# Altium project DVT-SPI_Buffer.PrjPcb (part 1 of 2)
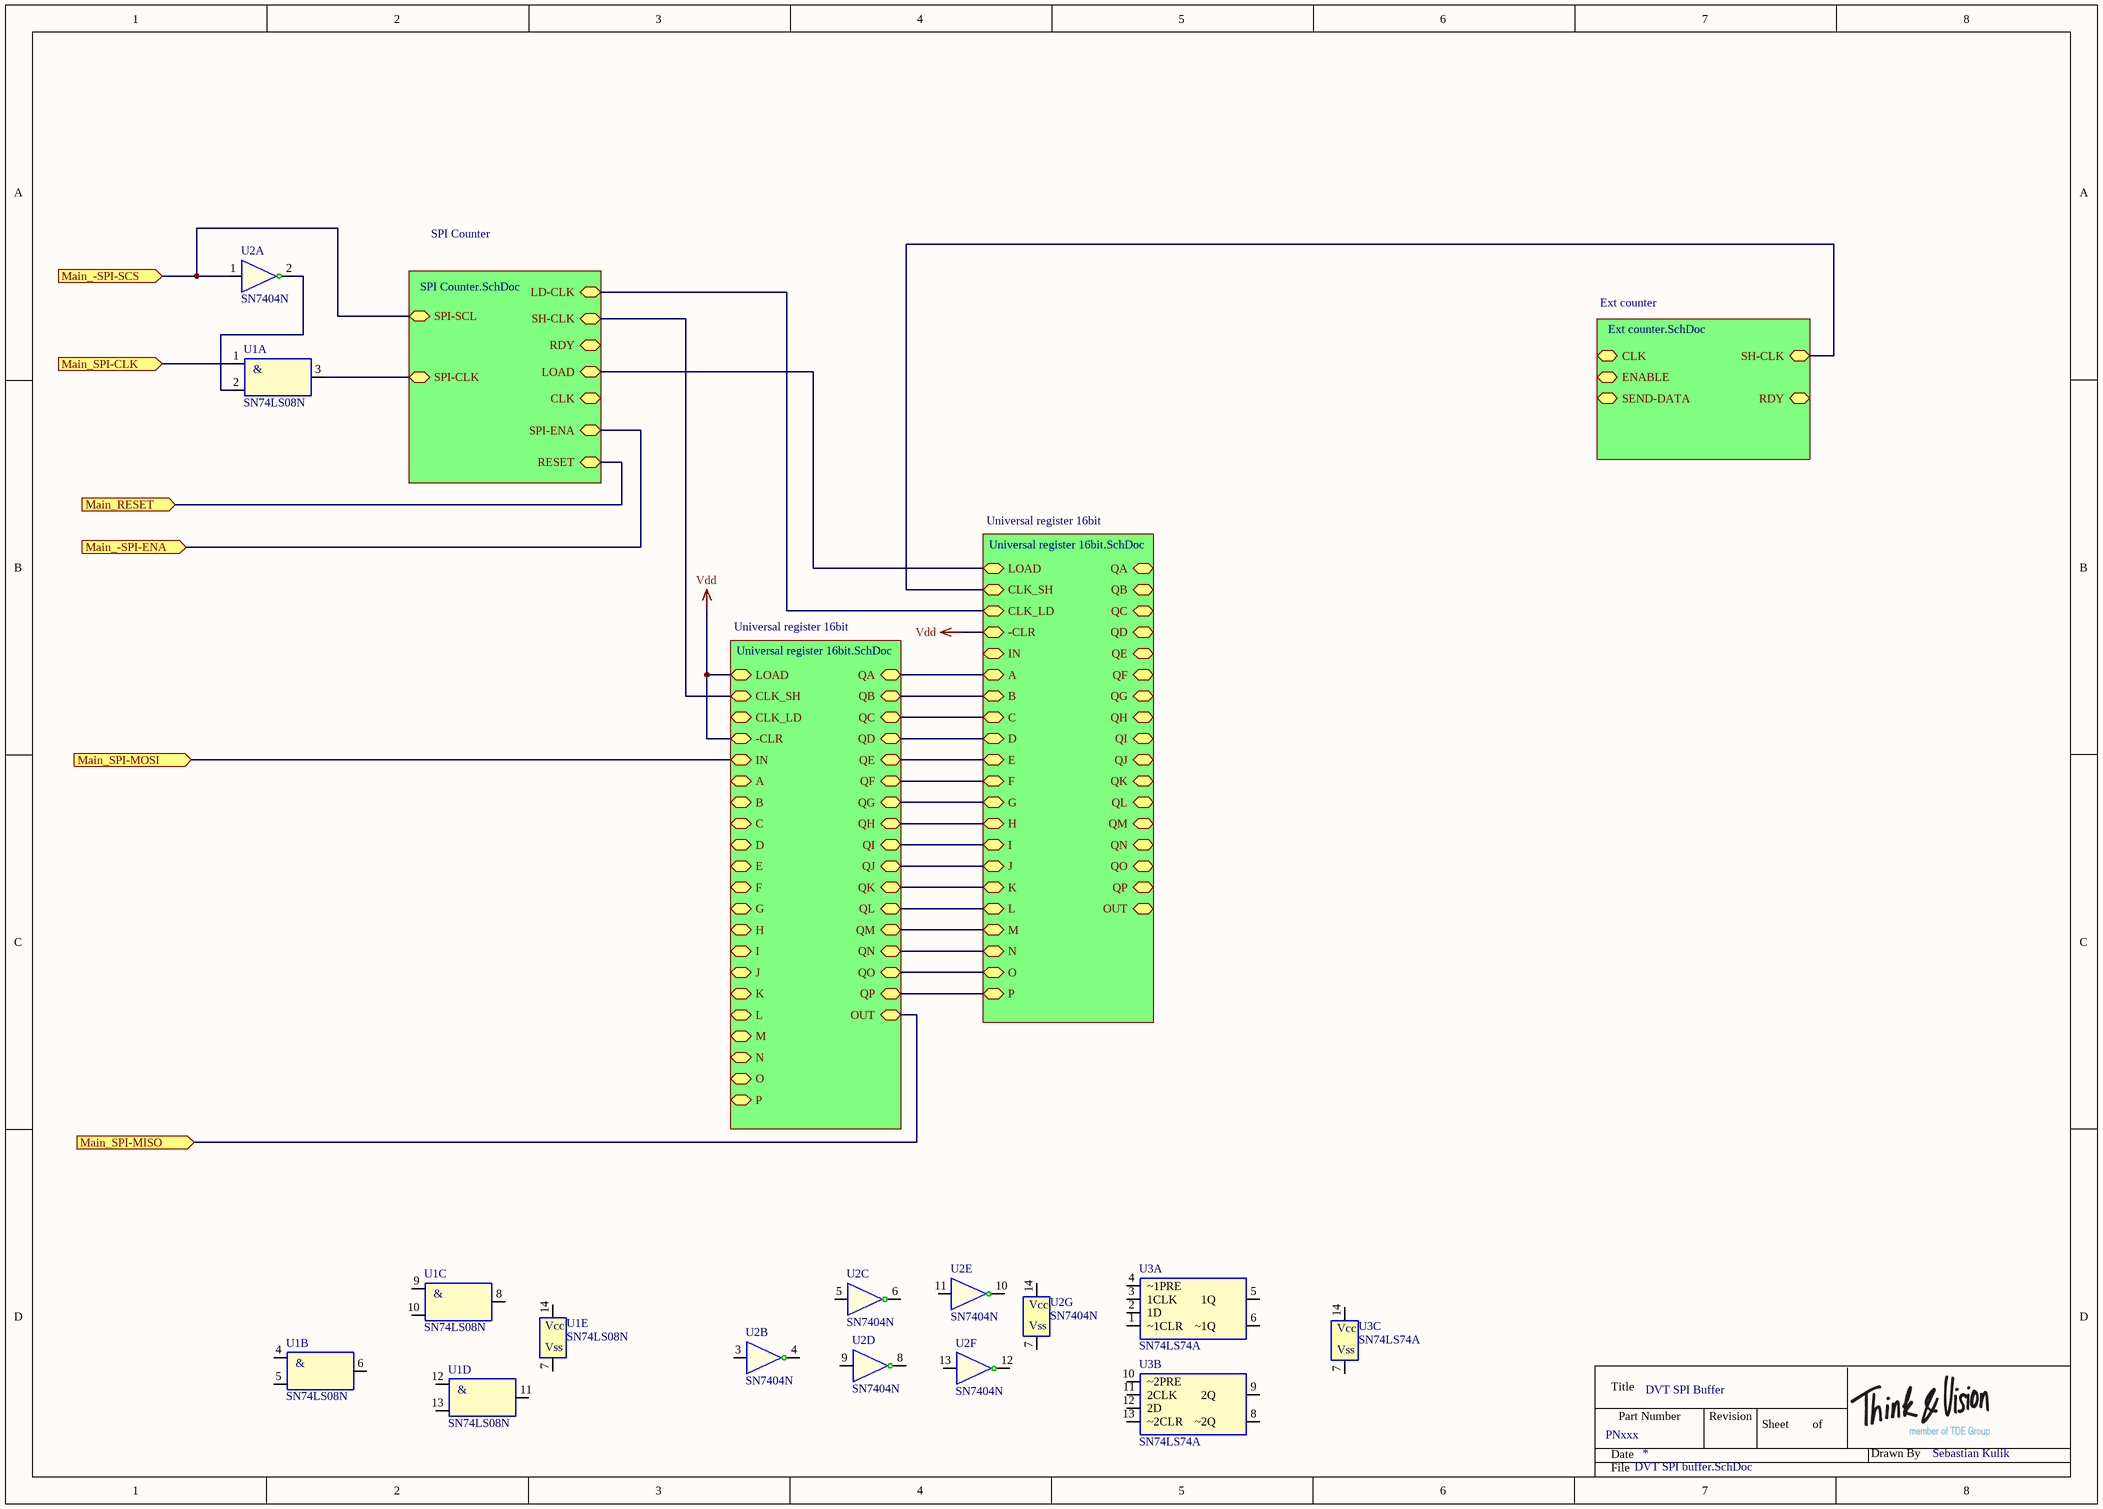
[diagram p0: DVT SPI buffer.SchDoc]
7 sheets, 125 parts. Net scope: hierarchical (ports join the sheet entries above them; power ports are global).
Sheets:
  DVT SPI buffer.SchDoc
    SPI Counter = SPI Counter.SchDoc
      J-K-Flip-Flop = J-K-Flip-Flop.SchDoc
    Universal register 16bit = Universal register 16bit.SchDoc
      Universal Register 4Bit = Universal Register 4Bit.SchDoc
        Quad 2x1 mux = Quad 2x1 mux.SchDoc
      Quad 2x1 mux = Quad 2x1 mux.SchDoc
      Universal Register 4Bit = Universal Register 4Bit.SchDoc
        Quad 2x1 mux = Quad 2x1 mux.SchDoc
      Universal Register 4Bit = Universal Register 4Bit.SchDoc
        Quad 2x1 mux = Quad 2x1 mux.SchDoc
      Universal Register 4Bit = Universal Register 4Bit.SchDoc
        Quad 2x1 mux = Quad 2x1 mux.SchDoc
    Ext counter = Ext counter.SchDoc
    Universal register 16bit = Universal register 16bit.SchDoc
      Universal Register 4Bit = Universal Register 4Bit.SchDoc
        Quad 2x1 mux = Quad 2x1 mux.SchDoc
      Quad 2x1 mux = Quad 2x1 mux.SchDoc
      Universal Register 4Bit = Universal Register 4Bit.SchDoc
        Quad 2x1 mux = Quad 2x1 mux.SchDoc
      Universal Register 4Bit = Universal Register 4Bit.SchDoc
        Quad 2x1 mux = Quad 2x1 mux.SchDoc
      Universal Register 4Bit = Universal Register 4Bit.SchDoc
        Quad 2x1 mux = Quad 2x1 mux.SchDoc

## Sheet DVT SPI buffer.SchDoc: DVT SPI Buffer
size A3; Revision: 1; SheetNumber: 1; SheetTotal: ?; PartNumber: PNxxx; Drawn By: Sebastian Kulik; ProjectName: DVT SPI Buffer

### Parts
(Parts that share a designator on the sheet are numbered #1, #2 ... from top to bottom, then left to right.)
U1#1  SN74LS08N  [DIP-14]  (parts A,B,C,D,E of 5)
U2#1  SN7404N  [DIP-14]  (parts A,B,C,D,E,F,G of 7)
U3#1  SN74LS74A  [DIP-14]  (parts A,B,C of 3)

### Sub-sheets
Ext counter = Ext counter.SchDoc: CLK, ENABLE, SEND-DATA, SH-CLK, RDY
SPI Counter = SPI Counter.SchDoc: SPI-SCL, CLK, SPI-CLK, LD-CLK, SH-CLK, RDY, LOAD, RESET, SPI-ENA
Universal register 16bit = Universal register 16bit.SchDoc: LOAD, CLK_SH, CLK_LD, -CLR, IN, A, B, C, D, E, F, G, H, I, J, K, L, M, N, O, QA, QB, QC, QD, QE, QF, QG, QH, QI, QJ, QK, QL, QM, QN, QO, QP, OUT, P
Universal register 16bit = Universal register 16bit.SchDoc: LOAD, CLK_SH, CLK_LD, -CLR, IN, A, B, C, D, E, F, G, H, I, J, K, L, M, N, O, QA, QB, QC, QD, QE, QF, QG, QH, QI, QJ, QK, QL, QM, QN, QO, QP, OUT, P

### Ports
Main_-SPI-ENA (in), Main_-SPI-SCS (in), Main_RESET (in), Main_SPI-CLK (in), Main_SPI-MISO (in), Main_SPI-MOSI (in)

### Nets
Vdd: sheet Universal register 16bit/LOAD, sheet Universal register 16bit/-CLR, sheet Universal register 16bit/-CLR
NetU1#1_1: U1#1.1(1A) ; port Main_SPI-CLK
NetU1#1_2: U1#1.2(1B) U2#1.2(1Y)
NetU1#1_3: U1#1.3(Y1) ; sheet SPI Counter/SPI-CLK
NetU1#2_5: U2#1.1(1A) ; port Main_-SPI-SCS, sheet SPI Counter/SPI-SCL
NetU1#2_11: sheet SPI Counter/LD-CLK, sheet Universal register 16bit/CLK_LD
NetU1_Universal_register_16bit_Quad_2x1_mux#2_1: sheet SPI Counter/LOAD, sheet Universal register 16bit/LOAD
NetU1_Universal_register_16bit_Universal_Register_4Bit#1_5: sheet Universal register 16bit/QA, sheet Universal register 16bit/A
NetU1_Universal_register_16bit_Universal_Register_4Bit#1_9: sheet Universal register 16bit/QB, sheet Universal register 16bit/B
NetU1_Universal_register_16bit_Universal_Register_4Bit#2_5: sheet Universal register 16bit/QE, sheet Universal register 16bit/E
NetU1_Universal_register_16bit_Universal_Register_4Bit#2_9: sheet Universal register 16bit/QF, sheet Universal register 16bit/F
NetU1_Universal_register_16bit_Universal_Register_4Bit#3_5: sheet Universal register 16bit/QI, sheet Universal register 16bit/I
NetU1_Universal_register_16bit_Universal_Register_4Bit#3_9: sheet Universal register 16bit/QJ, sheet Universal register 16bit/J
NetU1_Universal_register_16bit_Universal_Register_4Bit#4_5: sheet Universal register 16bit/QM, sheet Universal register 16bit/M
NetU1_Universal_register_16bit_Universal_Register_4Bit#4_9: sheet Universal register 16bit/QN, sheet Universal register 16bit/N
NetU2#2_11: sheet SPI Counter/SH-CLK, sheet Universal register 16bit/CLK_SH
NetU2_Universal_register_16bit_Quad_2x1_mux#2_1: sheet Ext counter/SH-CLK, sheet Universal register 16bit/CLK_SH
NetU2_Universal_register_16bit_Universal_Register_4Bit#1_5: sheet Universal register 16bit/QC, sheet Universal register 16bit/C
NetU2_Universal_register_16bit_Universal_Register_4Bit#1_9: sheet Universal register 16bit/QD, sheet Universal register 16bit/D
NetU2_Universal_register_16bit_Universal_Register_4Bit#2_5: sheet Universal register 16bit/QG, sheet Universal register 16bit/G
NetU2_Universal_register_16bit_Universal_Register_4Bit#2_9: sheet Universal register 16bit/QH, sheet Universal register 16bit/H
NetU2_Universal_register_16bit_Universal_Register_4Bit#3_5: sheet Universal register 16bit/QK, sheet Universal register 16bit/K
NetU2_Universal_register_16bit_Universal_Register_4Bit#3_9: sheet Universal register 16bit/QL, sheet Universal register 16bit/L
NetU2_Universal_register_16bit_Universal_Register_4Bit#4_5: sheet Universal register 16bit/QO, sheet Universal register 16bit/O
NetU2_Universal_register_16bit_Universal_Register_4Bit#4_9: port Main_SPI-MISO, sheet Universal register 16bit/QP, sheet Universal register 16bit/OUT, sheet Universal register 16bit/P
NetU2_Universal_register_16bit_Universal_Register_4Bit#8_9: sheet Universal register 16bit/QP, sheet Universal register 16bit/OUT
NetU2_Universal_register_16bit_Universal_Register_4Bit_Quad_2x1_mux#1_1: port Main_SPI-MOSI, sheet Universal register 16bit/IN
NetU3#2_3: port Main_-SPI-ENA, sheet SPI Counter/SPI-ENA
NetU4#1_11: port Main_RESET, sheet SPI Counter/RESET

Not connected (* = marked no-connect by the designer): U1#1 4(2A) 5(2B) 6(Y2) 7(Vss) 8(Y3) 9(3A) 10(3B) 11(Y4) 12(4A) 13(4B) 14(Vcc); U2#1 3(2A) 4(2Y) 5(3A) 6(3Y) 7(Vss) 8(Y4) 9(4A) 10(5Y) 11(5A) 12(6Y) 13(6A) 14(Vcc); U3#1 1(~1CLR) 2(1D) 3(1CLK) 4(~1PRE) 5(1Q) 6(~1Q) 7(Vss) 8(~2Q) 9(2Q) 10(~2PRE) 11(2CLK) 12(2D) 13(~2CLR) 14(Vcc)

### Notes on the sheet
- Title
- Date
- Part Number
- Revision
- Sheet
- of
- Drawn By
- File
- (in symbol SN74LS08N, part A) &
- (in symbol SN74LS08N, part B) &
- (in symbol SN74LS08N, part C) &
- (in symbol SN74LS08N, part D) &

### Library data of the parts
U1#1 = SN74LS08N: Quad AND, TTL; Deliverer PartNr: 307-519; Manufacturer: TI; Deliverer: RS; TDE-PN: IC0088; Published: 24.11.2016; PackageDescription: DIP14; Publisher: Sebastian Kulik; Manufacturer PartNr: SN74LS08N; Price: 0.56
U2#1 = SN7404N: Hex Inverter TTL; Deliverer PartNr: 305-529; Manufacturer: TI; Deliverer: RS; TDE-PN: IC0086; Published: 24.11.2016; PackageDescription: DIP14; Publisher: Sebastian Kulik; Manufacturer PartNr: SN7404N; Price: 1
U3#1 = SN74LS74A: Flip-Flop Dual, TTL; Deliverer PartNr: 307-597; Manufacturer PartNr: SN74LS74AN; Manufacturer: TI; Deliverer: RS; TDE-PN: IC0089; Published: 24.11.2016; PackageDescription: DIP14; Publisher: Sebastian Kulik; Price: 0.48

## Sheet SPI Counter.SchDoc: SPI Counter
size A3; SheetNumber: 1; SheetTotal: 1; PartNumber: PNxxx; Drawn By: Sebastian Kulik; ProjectName: DVT SPI Buffer
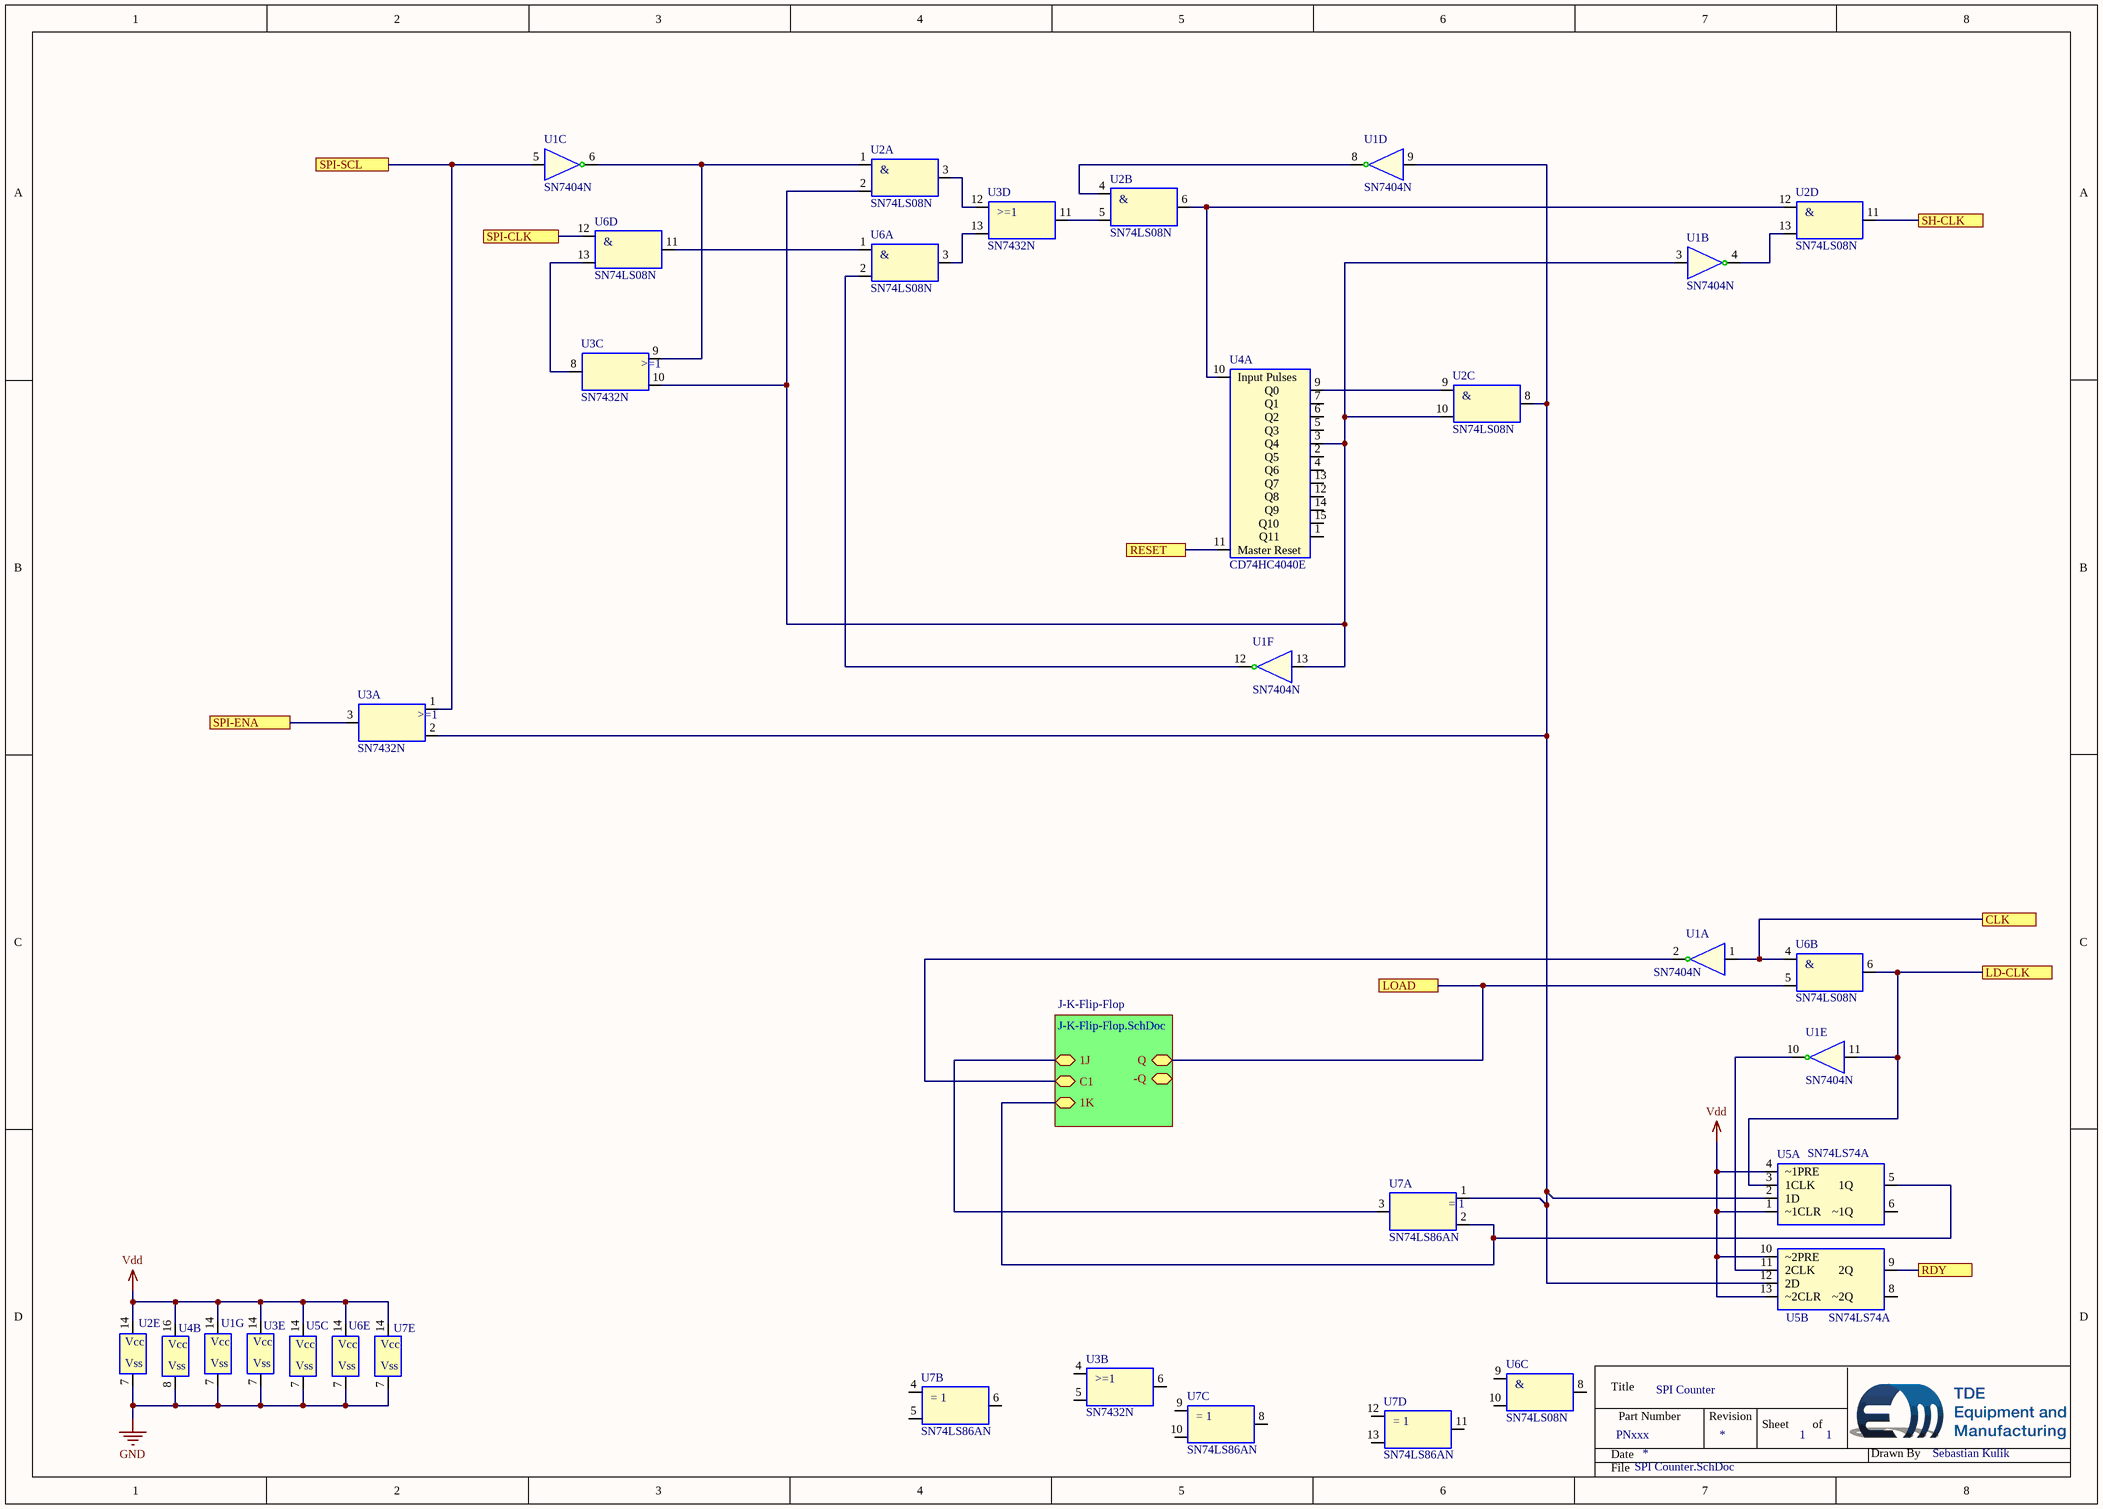
[diagram p1: SPI Counter.SchDoc]

### Parts
(Parts that share a designator on the sheet are numbered #1, #2 ... from top to bottom, then left to right.)
U1#2  SN7404N  [DIP-14]  (parts A,B,C,D,E,F,G of 7)
U2#2  SN74LS08N  [DIP-14]  (parts A,B,C,D,E of 5)
U3#2  SN7432N  [DIP-14]  (parts A,B,C,D,E of 5)
U4#1  CD74HC4040E  [DIP-16]  (parts A,B of 2)
U5#1  SN74LS74A  [DIP-14]  (parts A,B,C of 3)
U6#1  SN74LS08N  [DIP-14]  (parts A,B,C,D,E of 5)
U7  SN74LS86AN  [DIP-14]  (parts A,B,C,D,E of 5)

### Sub-sheets
J-K-Flip-Flop = J-K-Flip-Flop.SchDoc: 1J, C1, 1K, Q, -Q

### Ports
CLK, LD-CLK, LOAD, RDY, RESET, SH-CLK, SPI-CLK, SPI-ENA, SPI-SCL

### Nets
GND: U1#2.7(Vss) U2#2.7(Vss) U3#2.7(Vss) U4#1.8(Vss) U5#1.7(Vss) U6#1.7(Vss) U7.7(Vss)
Vdd: U1#2.14(Vcc) U2#2.14(Vcc) U3#2.14(Vcc) U4#1.16(Vcc) U5#1.1(~1CLR) U5#1.4(~1PRE) U5#1.10(~2PRE) U5#1.13(~2CLR) U5#1.14(Vcc) U6#1.14(Vcc) U7.14(Vcc)
NetCLK-DELAY_1: U1#2.2(1Y) ; sheet J-K-Flip-Flop/C1
NetU1#1_3: U6#1.12(4A) ; port SPI-CLK
NetU1#2_1: U1#2.1(1A) U6#1.4(2A) ; port CLK
NetU1#2_3: U1#2.3(2A) U1#2.13(6A) U2#2.2(1B) U2#2.10(3B) U3#2.10(3B) U4#1.3(Q4)
NetU1#2_4: U1#2.4(2Y) U2#2.13(4B)
NetU1#2_5: U1#2.5(3A) U3#2.1(1A) ; port SPI-SCL
NetU1#2_6: U1#2.6(3Y) U2#2.1(1A) U3#2.9(3A)
NetU1#2_8: U1#2.8(Y4) U2#2.4(2A)
NetU1#2_9: U1#2.9(4A) U2#2.8(Y3) U3#2.2(1B) U5#1.2(1D) U5#1.12(2D) U7.1(1A)
NetU1#2_10: U1#2.10(5Y) U5#1.11(2CLK)
NetU1#2_11: U1#2.11(5A) U5#1.3(1CLK) U6#1.6(Y2) ; port LD-CLK
NetU1#2_12: U1#2.12(6Y) U6#1.2(1B)
NetU1#3_11: U5#1.5(1Q) U7.2(1B) ; sheet J-K-Flip-Flop/1K
NetU1_Universal_register_16bit_Quad_2x1_mux#2_1: U6#1.5(2B) ; port LOAD, sheet J-K-Flip-Flop/Q
NetU2#2_3: U2#2.3(Y1) U3#2.12(4A)
NetU2#2_5: U2#2.5(2B) U3#2.11(Y4)
NetU2#2_6: U2#2.6(Y2) U2#2.12(4A) U4#1.10(Input_Pulses)
NetU2#2_9: U2#2.9(3A) U4#1.9(Q0)
NetU2#2_11: U2#2.11(Y4) ; port SH-CLK
NetU2#3_1: U7.3(Y1) ; sheet J-K-Flip-Flop/1J
NetU3#2_3: U3#2.3(Y1) ; port SPI-ENA
NetU3#2_8: U3#2.8(Y3) U6#1.13(4B)
NetU3#2_13: U3#2.13(4B) U6#1.3(Y1)
NetU4#1_11: U4#1.11(Master_Reset) ; port RESET
NetU5#1_9: U5#1.9(2Q) ; port RDY
NetU6#1_1: U6#1.1(1A) U6#1.11(Y4)

Not connected (* = marked no-connect by the designer): U3#2 4(2A) 5(2B) 6(Y2); U4#1 1(Q11) 2(Q5) 4(Q6) 5(Q3) 6(Q2) 7(Q1) 12(Q8) 13(Q7) 14(Q9) 15(Q10); U5#1 6(~1Q) 8(~2Q); U6#1 8(Y3) 9(3A) 10(3B); U7 4(2A) 5(2B) 6(Y2) 8(Y3) 9(3A) 10(3B) 11(Y4) 12(4A) 13(4B)

### Notes on the sheet
- Title
- Date
- Part Number
- Revision
- Sheet
- of
- Drawn By
- File
- (in symbol SN74LS08N, part A) &
- (in symbol SN74LS08N, part B) &
- (in symbol SN74LS08N, part C) &
- (in symbol SN74LS08N, part D) &
- (in symbol SN7432N, part A) >=1
- (in symbol SN7432N, part B) >=1
- (in symbol SN7432N, part C) >=1
- (in symbol SN7432N, part D) >=1

### Library data of the parts
U1#2 = SN7404N: as U2#1 on sheet DVT SPI buffer; Published: 24.11.2016; PackageDescription: DIP14; Publisher: Sebastian Kulik; Manufacturer PartNr: SN7404N; Price: 1
U2#2 U6#1 = SN74LS08N: as U1#1 on sheet DVT SPI buffer; Published: 24.11.2016; PackageDescription: DIP14; Publisher: Sebastian Kulik; Manufacturer PartNr: SN74LS08N; Price: 0.56
U3#2 = SN7432N: Quad NAND, TTL; Deliverer PartNr: 304-093; Manufacturer: TI; Deliverer: RS; TDE-PN: IC0087; Published: 24.11.2016; PackageDescription: DIP14; Publisher: Sebastian Kulik; Manufacturer PartNr: SN7432N; Price: 1.24
U4#1 = CD74HC4040E: High Speed CMOS Logic 12-Stage Binary Counter; Deliverer PartNr: 807-2457; Manufacturer: TI; Deliverer: RS; TDE-PN: IC0090; Published: 09.12.2016; PackageDescription: DIP16; Publisher: Sebastian Kulik; Manufacturer PartNr: CD74HC4040E; Price: 0.464/25
U5#1 = SN74LS74A: as U3#1 on sheet DVT SPI buffer; Published: 24.11.2016; PackageDescription: DIP14; Publisher: Sebastian Kulik; Price: 0.48
U7 = SN74LS86AN: Quad 2-input exclusive-OR gates; Deliverer PartNr: 304-093; Manufacturer: TI; Deliverer: RS; TDE-PN: IC0091; Published: 12.12.2016; PackageDescription: DIP14; Publisher: Sebastian Kulik; Manufacturer PartNr: SN74LS86AN; Price: 2.26/1

## Sheet J-K-Flip-Flop.SchDoc: J-K-Flip-Flop
size A4; Revision: 1; SheetNumber: 1; SheetTotal: 1; PartNumber: PNxxx; Drawn By: Sebastian Kulik
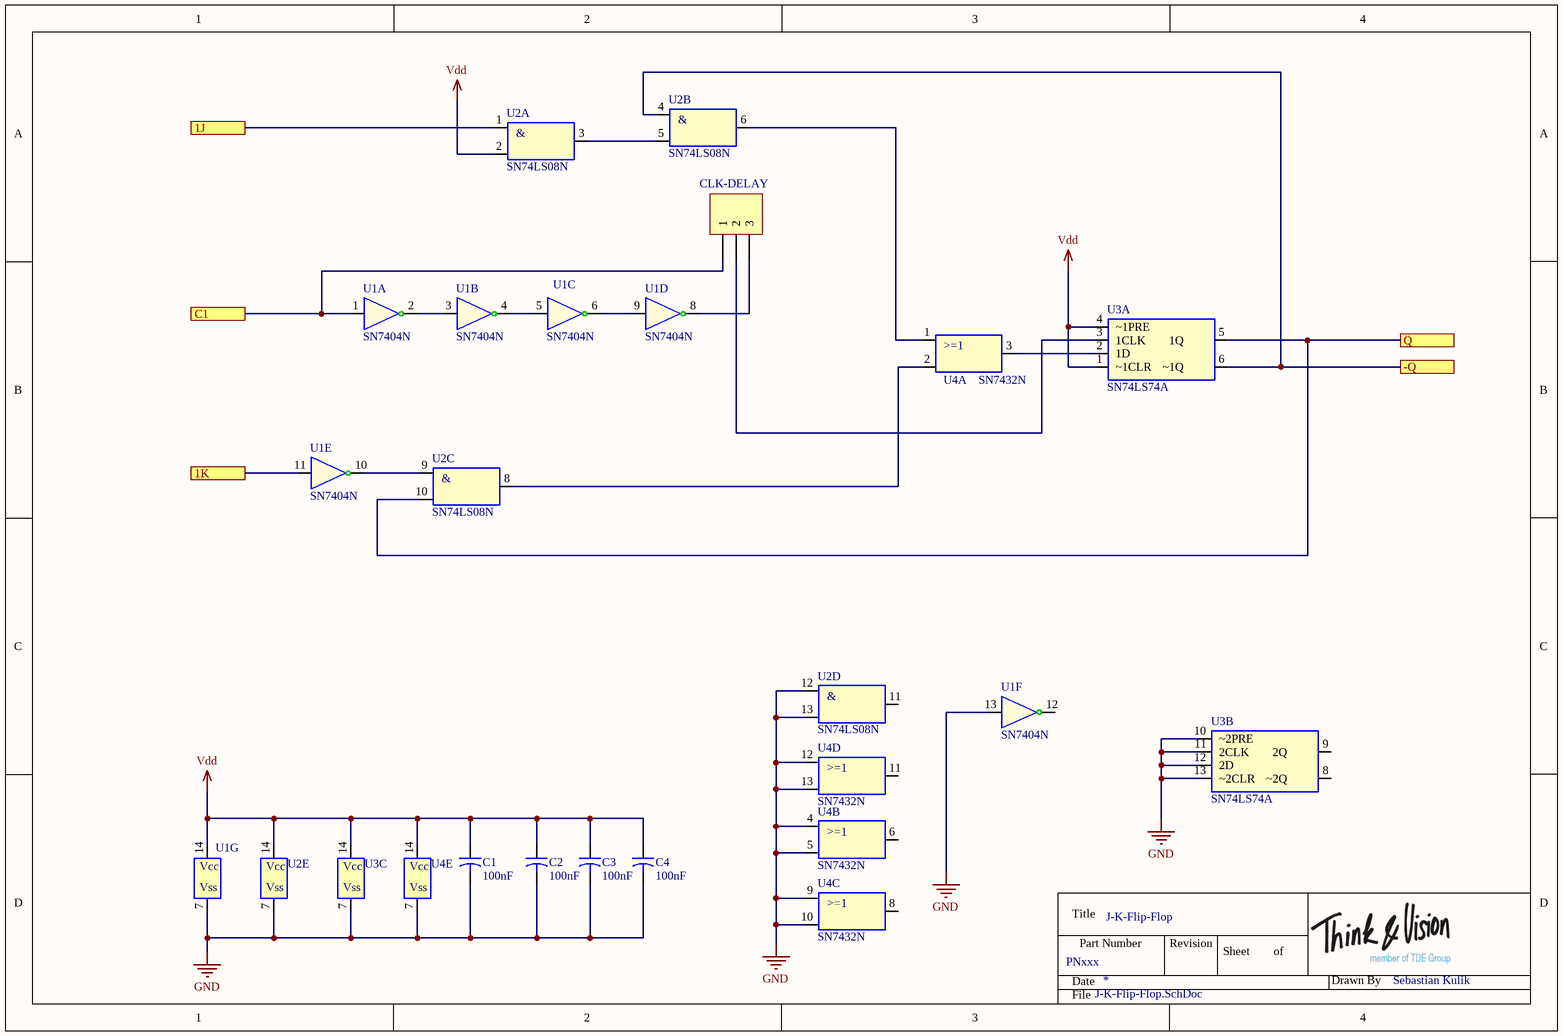
[diagram p2: J-K-Flip-Flop.SchDoc]

### Parts
(Parts that share a designator on the sheet are numbered #1, #2 ... from top to bottom, then left to right.)
C1#1  value 100nF  [Dummy-10mm]  (hidden comment: Capacitor-Dummy-THT)
C2#1  value 100nF  [Dummy-10mm]  (hidden comment: Capacitor-Dummy-THT)
C3#1  value 100nF  [Dummy-10mm]  (hidden comment: Capacitor-Dummy-THT)
C4#1  value 100nF  [Dummy-10mm]  (hidden comment: Capacitor-Dummy-THT)
CLK-DELAY  Plug_3_90_2.54  [HDR1X3]  (value not drawn)
U1#3  SN7404N  [DIP-14]  (parts A,B,C,D,E,F,G of 7)
U2#3  SN74LS08N  [DIP-14]  (parts A,B,C,D,E of 5)
U3#3  SN74LS74A  [DIP-14]  (parts A,B,C of 3)
U4#2  SN7432N  [DIP-14]  (parts A,B,C,D,E of 5)

### Ports
1J, 1K, -Q, C1, Q

### Nets
GND: C1#1.2 C2#1.2 C3#1.2 C4#1.2 U1#3.7(Vss) U1#3.13(6A) U2#3.7(Vss) U2#3.12(4A) U2#3.13(4B) U3#3.7(Vss) U3#3.10(~2PRE) U3#3.11(2CLK) U3#3.12(2D) U3#3.13(~2CLR) U4#2.4(2A) U4#2.5(2B) U4#2.7(Vss) U4#2.9(3A) U4#2.10(3B) U4#2.12(4A) U4#2.13(4B)
Vdd: C1#1.1 C2#1.1 C3#1.1 C4#1.1 U1#3.14(Vcc) U2#3.2(1B) U2#3.14(Vcc) U3#3.1(~1CLR) U3#3.4(~1PRE) U3#3.14(Vcc) U4#2.14(Vcc)
NetCLK-DELAY_1: CLK-DELAY.1 U1#3.1(1A) ; port C1
NetCLK-DELAY_2: CLK-DELAY.2 U3#3.3(1CLK)
NetCLK-DELAY_3: CLK-DELAY.3 U1#3.8(Y4)
NetU1#3_2: U1#3.2(1Y) U1#3.3(2A)
NetU1#3_4: U1#3.4(2Y) U1#3.5(3A)
NetU1#3_6: U1#3.6(3Y) U1#3.9(4A)
NetU1#3_10: U1#3.10(5Y) U2#3.9(3A)
NetU1#3_11: U1#3.11(5A) ; port 1K
NetU1_Universal_register_16bit_Quad_2x1_mux#2_1: U2#3.10(3B) U3#3.5(1Q) ; port Q
NetU2#3_1: U2#3.1(1A) ; port 1J
NetU2#3_3: U2#3.3(Y1) U2#3.5(2B)
NetU2#3_4: U2#3.4(2A) U3#3.6(~1Q) ; port -Q
NetU2#3_6: U2#3.6(Y2) U4#2.1(1A)
NetU2#3_8: U2#3.8(Y3) U4#2.2(1B)
NetU3#3_2: U3#3.2(1D) U4#2.3(Y1)

Not connected (* = marked no-connect by the designer): U1#3 12(6Y); U2#3 11(Y4); U3#3 8(~2Q) 9(2Q); U4#2 6(Y2) 8(Y3) 11(Y4)

### Notes on the sheet
- Title
- Date
- Part Number
- Revision
- Sheet
- of
- Drawn By
- File
- (in symbol SN74LS08N, part A) &
- (in symbol SN74LS08N, part B) &
- (in symbol SN74LS08N, part C) &
- (in symbol SN74LS08N, part D) &
- (in symbol SN7432N, part A) >=1
- (in symbol SN7432N, part B) >=1
- (in symbol SN7432N, part C) >=1
- (in symbol SN7432N, part D) >=1

### Library data of the parts
C1#1 C2#1 C3#1 C4#1 = Capacitor-Dummy-THT: Deliverer PartNr: 721-5240; Deliverer: RS; Published: 08.12.2015; Part Description: Capacitor-Dummy-THT; Publisher: Sebastian Kulik; PackageDescription: -; Manufacturer: -; Manufacturer PartNr: -; TDE-PN: -; Price: 0.081/50
CLK-DELAY = Plug_3_90_2.54: Plug,-3-Pin; Manufacturer: WE; Manufacturer PartNr: 61300311021; Deliverer PartNr: 828-1585; Deliverer: RS; TDE-PN: CON0011; Publisher: Sebastian Kulik; Price: 0.138/5
U1#3 = SN7404N: as U2#1 on sheet DVT SPI buffer; Published: 24.11.2016; PackageDescription: DIP14; Publisher: Sebastian Kulik; Manufacturer PartNr: SN7404N; Price: 1
U2#3 = SN74LS08N: as U1#1 on sheet DVT SPI buffer; Published: 24.11.2016; PackageDescription: DIP14; Publisher: Sebastian Kulik; Manufacturer PartNr: SN74LS08N; Price: 0.56
U3#3 = SN74LS74A: as U3#1 on sheet DVT SPI buffer; Published: 24.11.2016; PackageDescription: DIP14; Publisher: Sebastian Kulik; Price: 0.48
U4#2 = SN7432N: as U3#2 on sheet SPI Counter; Published: 24.11.2016; PackageDescription: DIP14; Publisher: Sebastian Kulik; Manufacturer PartNr: SN7432N; Price: 1.24

## Sheet Universal register 16bit.SchDoc
size A3; PartNumber: PNxxx; Drawn By: Me?
Used 2 times, as channels Universal register 16bit, Universal register 16bit. Parts and nets are listed once, with the designators drawn on the sheet.
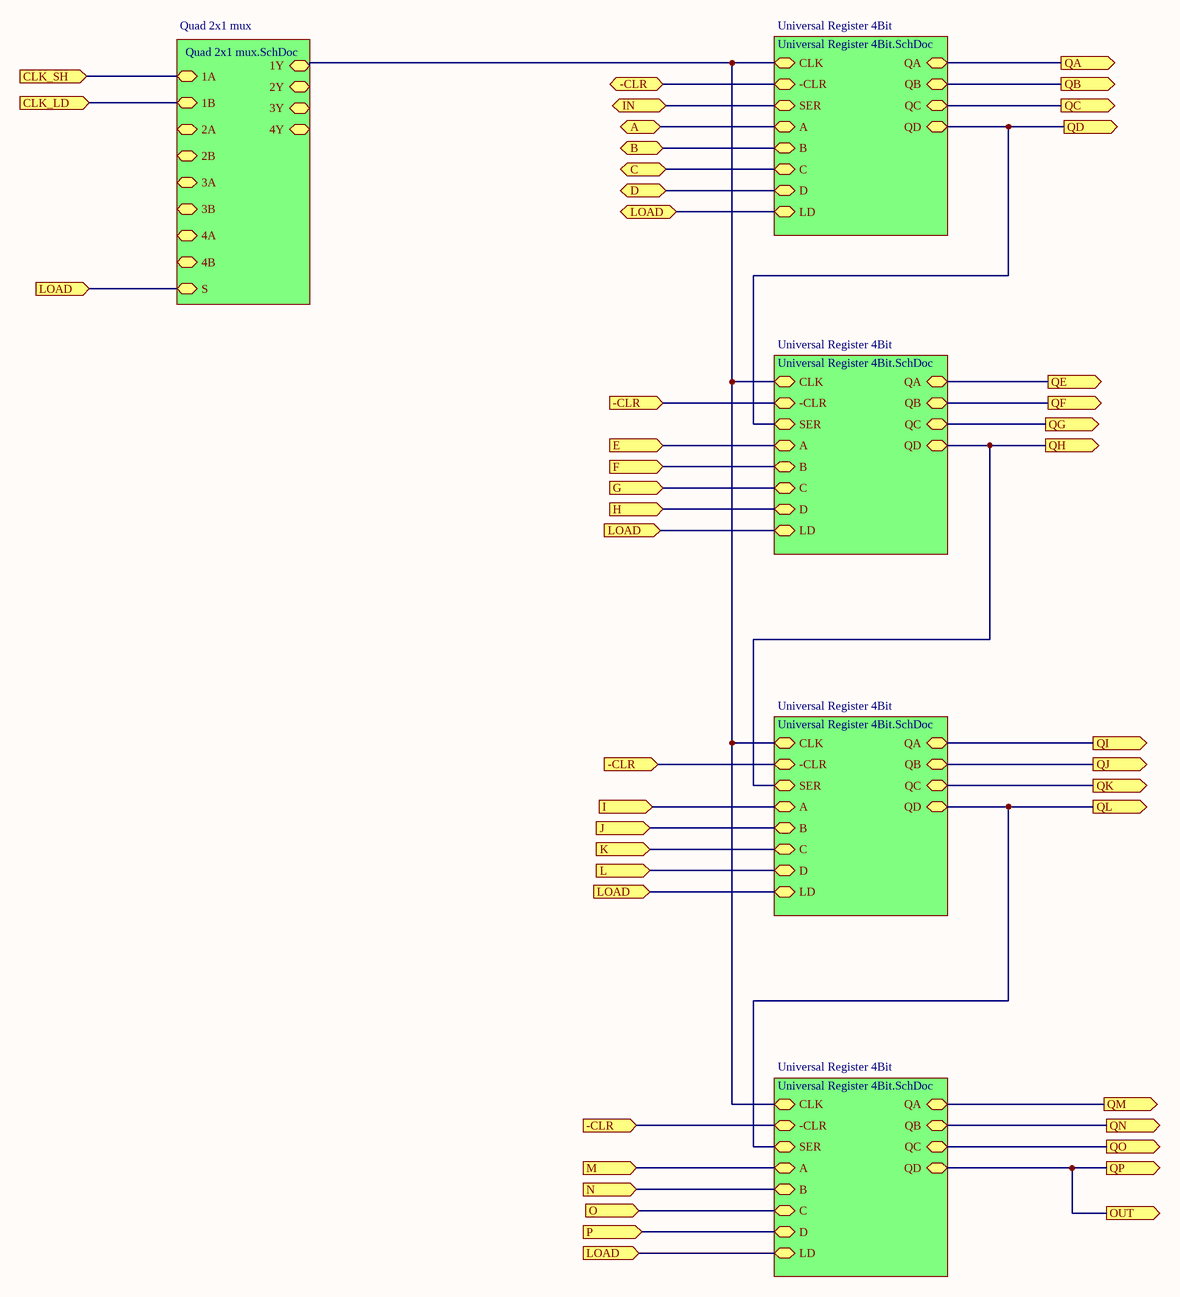
[diagram p3: Universal register 16bit.SchDoc]

### Sub-sheets
Quad 2x1 mux = Quad 2x1 mux.SchDoc: 1A, 1B, 2A, 2B, 3A, 3B, 4A, 4B, S, 1Y, 2Y, 3Y, 4Y
Universal Register 4Bit = Universal Register 4Bit.SchDoc: CLK, -CLR, SER, A, B, C, D, LD, QA, QB, QC, QD
Universal Register 4Bit = Universal Register 4Bit.SchDoc: CLK, -CLR, SER, A, B, C, D, LD, QA, QB, QC, QD
Universal Register 4Bit = Universal Register 4Bit.SchDoc: CLK, -CLR, SER, A, B, C, D, LD, QA, QB, QC, QD
Universal Register 4Bit = Universal Register 4Bit.SchDoc: CLK, -CLR, SER, A, B, C, D, LD, QA, QB, QC, QD

### Ports
-CLR (bidir), -CLR (in), A (bidir), B (bidir), C (bidir), CLK_LD (in), CLK_SH (in), D (bidir), E (in), F (in), G (in), H (in), I (in), IN (bidir), J (in), K (in), L (in), LOAD (bidir), LOAD (in), M (in), N (in), O (in), OUT (out), P (in), QA (out), QB (out), QC (out), QD (out), QE (out), QF (out), QG (out), QH (out), QI (out), QJ (out), QK (out), QL (out), QM (out), QN (out), QO (out), QP (out)

### Nets
-CLR: port -CLR, sheet Universal Register 4Bit/-CLR, sheet Universal Register 4Bit/-CLR, sheet Universal Register 4Bit/-CLR, sheet Universal Register 4Bit/-CLR
A: port A, sheet Universal Register 4Bit/A
B: port B, sheet Universal Register 4Bit/B
C: port C, sheet Universal Register 4Bit/C
CLK_LD: port CLK_LD, sheet Quad 2x1 mux/1B
CLK_SH: port CLK_SH, sheet Quad 2x1 mux/1A
D: port D, sheet Universal Register 4Bit/D
E: port E, sheet Universal Register 4Bit/A
F: port F, sheet Universal Register 4Bit/B
G: port G, sheet Universal Register 4Bit/C
H: port H, sheet Universal Register 4Bit/D
I: port I, sheet Universal Register 4Bit/A
IN: port IN, sheet Universal Register 4Bit/SER
J: port J, sheet Universal Register 4Bit/B
K: port K, sheet Universal Register 4Bit/C
L: port L, sheet Universal Register 4Bit/D
LOAD: port LOAD, sheet Universal Register 4Bit/LD, sheet Quad 2x1 mux/S, sheet Universal Register 4Bit/LD, sheet Universal Register 4Bit/LD, sheet Universal Register 4Bit/LD
M: port M, sheet Universal Register 4Bit/A
N: port N, sheet Universal Register 4Bit/B
O: port O, sheet Universal Register 4Bit/C
OUT: port QP, port OUT, sheet Universal Register 4Bit/QD
P: port P, sheet Universal Register 4Bit/D
QA: port QA, sheet Universal Register 4Bit/QA
QB: port QB, sheet Universal Register 4Bit/QB
QC: port QC, sheet Universal Register 4Bit/QC
QD: port QD, sheet Universal Register 4Bit/QD, sheet Universal Register 4Bit/SER
QE: port QE, sheet Universal Register 4Bit/QA
QF: port QF, sheet Universal Register 4Bit/QB
QG: port QG, sheet Universal Register 4Bit/QC
QH: port QH, sheet Universal Register 4Bit/QD, sheet Universal Register 4Bit/SER
QI: port QI, sheet Universal Register 4Bit/QA
QJ: port QJ, sheet Universal Register 4Bit/QB
QK: port QK, sheet Universal Register 4Bit/QC
QL: port QL, sheet Universal Register 4Bit/QD, sheet Universal Register 4Bit/SER
QM: port QM, sheet Universal Register 4Bit/QA
QN: port QN, sheet Universal Register 4Bit/QB
QO: port QO, sheet Universal Register 4Bit/QC
(unnamed): sheet Universal Register 4Bit/CLK, sheet Quad 2x1 mux/1Y, sheet Universal Register 4Bit/CLK, sheet Universal Register 4Bit/CLK, sheet Universal Register 4Bit/CLK

### Channels
Universal register 16bit: ports -CLR=Vdd A=NetU2_Universal_register_16bit_Universal_Register_4Bit_Quad_2x1_mux#1_5 B=NetU2_Universal_register_16bit_Universal_Register_4Bit_Quad_2x1_mux#1_13 C=NetU3_Universal_register_16bit_Universal_Register_4Bit_Quad_2x1_mux#1_5 CLK_LD=NetU2_Universal_register_16bit_Quad_2x1_mux#1_5 CLK_SH=NetU2#2_11 D=NetU3_Universal_register_16bit_Universal_Register_4Bit_Quad_2x1_mux#1_13 E=NetU2_Universal_register_16bit_Universal_Register_4Bit_Quad_2x1_mux#2_5 F=NetU2_Universal_register_16bit_Universal_Register_4Bit_Quad_2x1_mux#2_13 G=NetU3_Universal_register_16bit_Universal_Register_4Bit_Quad_2x1_mux#2_5 H=NetU3_Universal_register_16bit_Universal_Register_4Bit_Quad_2x1_mux#2_13 I=NetU2_Universal_register_16bit_Universal_Register_4Bit_Quad_2x1_mux#3_5 IN=NetU2_Universal_register_16bit_Universal_Register_4Bit_Quad_2x1_mux#1_1 J=NetU2_Universal_register_16bit_Universal_Register_4Bit_Quad_2x1_mux#3_13 K=NetU3_Universal_register_16bit_Universal_Register_4Bit_Quad_2x1_mux#3_5 L=NetU3_Universal_register_16bit_Universal_Register_4Bit_Quad_2x1_mux#3_13 LOAD=Vdd M=NetU2_Universal_register_16bit_Universal_Register_4Bit_Quad_2x1_mux#4_5 N=NetU2_Universal_register_16bit_Universal_Register_4Bit_Quad_2x1_mux#4_13 O=NetU3_Universal_register_16bit_Universal_Register_4Bit_Quad_2x1_mux#4_5 OUT=NetU2_Universal_register_16bit_Universal_Register_4Bit#4_9 P=NetU3_Universal_register_16bit_Universal_Register_4Bit_Quad_2x1_mux#4_13 QA=NetU1_Universal_register_16bit_Universal_Register_4Bit#1_5 QB=NetU1_Universal_register_16bit_Universal_Register_4Bit#1_9 QC=NetU2_Universal_register_16bit_Universal_Register_4Bit#1_5 QD=NetU2_Universal_register_16bit_Universal_Register_4Bit#1_9 QE=NetU1_Universal_register_16bit_Universal_Register_4Bit#2_5 QF=NetU1_Universal_register_16bit_Universal_Register_4Bit#2_9 QG=NetU2_Universal_register_16bit_Universal_Register_4Bit#2_5 QH=NetU2_Universal_register_16bit_Universal_Register_4Bit#2_9 QI=NetU1_Universal_register_16bit_Universal_Register_4Bit#3_5 QJ=NetU1_Universal_register_16bit_Universal_Register_4Bit#3_9 QK=NetU2_Universal_register_16bit_Universal_Register_4Bit#3_5 QL=NetU2_Universal_register_16bit_Universal_Register_4Bit#3_9 QM=NetU1_Universal_register_16bit_Universal_Register_4Bit#4_5 QN=NetU1_Universal_register_16bit_Universal_Register_4Bit#4_9 QO=NetU2_Universal_register_16bit_Universal_Register_4Bit#4_5 QP=NetU2_Universal_register_16bit_Universal_Register_4Bit#4_9
Universal register 16bit: ports -CLR=Vdd A=NetU1_Universal_register_16bit_Universal_Register_4Bit#1_5 B=NetU1_Universal_register_16bit_Universal_Register_4Bit#1_9 C=NetU2_Universal_register_16bit_Universal_Register_4Bit#1_5 CLK_LD=NetU1#2_11 CLK_SH=NetU2_Universal_register_16bit_Quad_2x1_mux#2_1 D=NetU2_Universal_register_16bit_Universal_Register_4Bit#1_9 E=NetU1_Universal_register_16bit_Universal_Register_4Bit#2_5 F=NetU1_Universal_register_16bit_Universal_Register_4Bit#2_9 G=NetU2_Universal_register_16bit_Universal_Register_4Bit#2_5 H=NetU2_Universal_register_16bit_Universal_Register_4Bit#2_9 I=NetU1_Universal_register_16bit_Universal_Register_4Bit#3_5 IN=NetU2_Universal_register_16bit_Universal_Register_4Bit_Quad_2x1_mux#5_1 J=NetU1_Universal_register_16bit_Universal_Register_4Bit#3_9 K=NetU2_Universal_register_16bit_Universal_Register_4Bit#3_5 L=NetU2_Universal_register_16bit_Universal_Register_4Bit#3_9 LOAD=NetU1_Universal_register_16bit_Quad_2x1_mux#2_1 M=NetU1_Universal_register_16bit_Universal_Register_4Bit#4_5 N=NetU1_Universal_register_16bit_Universal_Register_4Bit#4_9 O=NetU2_Universal_register_16bit_Universal_Register_4Bit#4_5 OUT=NetU2_Universal_register_16bit_Universal_Register_4Bit#8_9 P=NetU2_Universal_register_16bit_Universal_Register_4Bit#4_9 QA=NetU1_Universal_register_16bit_Universal_Register_4Bit#5_5 QB=NetU1_Universal_register_16bit_Universal_Register_4Bit#5_9 QC=NetU2_Universal_register_16bit_Universal_Register_4Bit#5_5 QD=NetU2_Universal_register_16bit_Universal_Register_4Bit#5_9 QE=NetU1_Universal_register_16bit_Universal_Register_4Bit#6_5 QF=NetU1_Universal_register_16bit_Universal_Register_4Bit#6_9 QG=NetU2_Universal_register_16bit_Universal_Register_4Bit#6_5 QH=NetU2_Universal_register_16bit_Universal_Register_4Bit#6_9 QI=NetU1_Universal_register_16bit_Universal_Register_4Bit#7_5 QJ=NetU1_Universal_register_16bit_Universal_Register_4Bit#7_9 QK=NetU2_Universal_register_16bit_Universal_Register_4Bit#7_5 QL=NetU2_Universal_register_16bit_Universal_Register_4Bit#7_9 QM=NetU1_Universal_register_16bit_Universal_Register_4Bit#8_5 QN=NetU1_Universal_register_16bit_Universal_Register_4Bit#8_9 QO=NetU2_Universal_register_16bit_Universal_Register_4Bit#8_5 QP=NetU2_Universal_register_16bit_Universal_Register_4Bit#8_9

### Notes on the sheet
- Title
- Date
- Part Number
- Revision
- Sheet
- of
- Drawn By
- File

## Sheet Universal Register 4Bit.SchDoc: Universal Register 4Bit
size A4; SheetNumber: 1; SheetTotal: 1; PartNumber: PNxxx; Drawn By: Sebastian Kulik; ProjectName: DVT SPI Buffer
Used 8 times, as channels Universal register 16bit/Universal Register 4Bit, Universal register 16bit/Universal Register 4Bit, Universal register 16bit/Universal Register 4Bit, Universal register 16bit/Universal Register 4Bit, Universal register 16bit/Universal Register 4Bit, Universal register 16bit/Universal Register 4Bit, Universal register 16bit/Universal Register 4Bit, Universal register 16bit/Universal Register 4Bit. Parts and nets are listed once, with the designators drawn on the sheet.
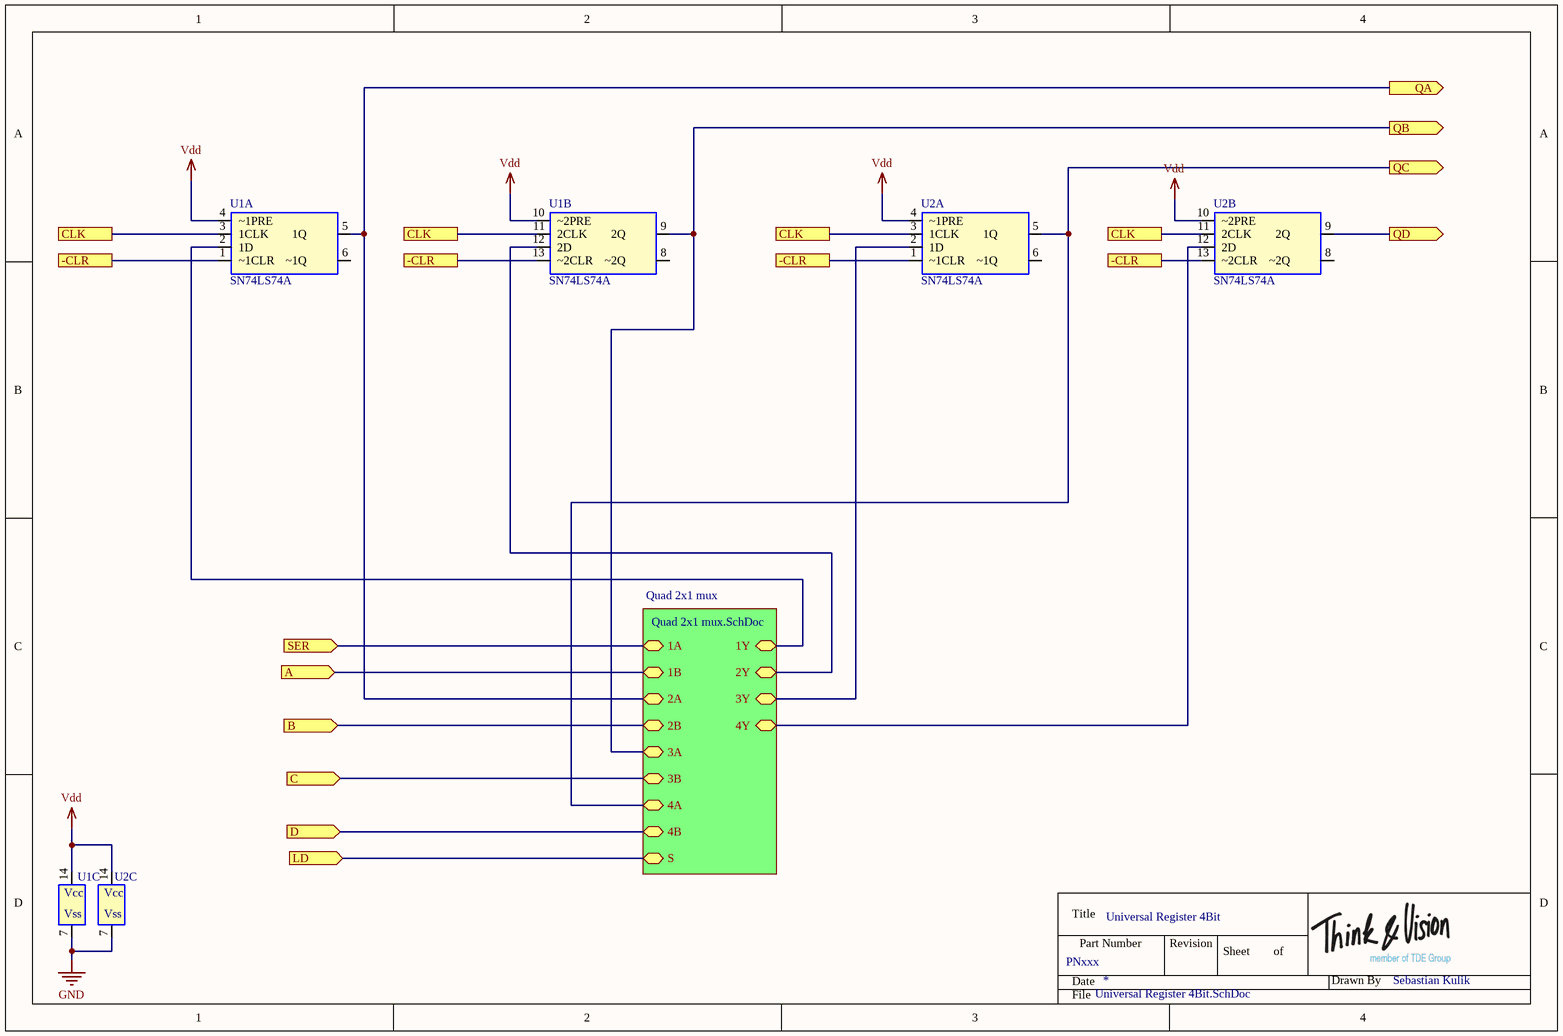
[diagram p4: Universal Register 4Bit.SchDoc]

### Parts
U1  SN74LS74A  [DIP-14]  (parts A,B,C of 3)
U2  SN74LS74A  [DIP-14]  (parts A,B,C of 3)

### Sub-sheets
Quad 2x1 mux = Quad 2x1 mux.SchDoc: 1A, 1B, 2A, 2B, 3A, 3B, 4A, 4B, S, 1Y, 2Y, 3Y, 4Y

### Ports
-CLR, A (in), B (in), C (in), CLK, D (in), LD (in), QA (out), QB (out), QC (out), QD (out), SER (in)

### Nets
GND: U1.7(Vss) U2.7(Vss)
Vdd: U1.4(~1PRE) U1.10(~2PRE) U1.14(Vcc) U2.4(~1PRE) U2.10(~2PRE) U2.14(Vcc)
-CLR: U1.1(~1CLR) U1.13(~2CLR) U2.1(~1CLR) U2.13(~2CLR) ; port -CLR
A: port A, sheet Quad 2x1 mux/1B
B: port B, sheet Quad 2x1 mux/2B
C: port C, sheet Quad 2x1 mux/3B
CLK: U1.3(1CLK) U1.11(2CLK) U2.3(1CLK) U2.11(2CLK) ; port CLK
D: port D, sheet Quad 2x1 mux/4B
LD: port LD, sheet Quad 2x1 mux/S
QA: U1.5(1Q) ; port QA, sheet Quad 2x1 mux/2A
QB: U1.9(2Q) ; port QB, sheet Quad 2x1 mux/3A
QC: U2.5(1Q) ; port QC, sheet Quad 2x1 mux/4A
QD: U2.9(2Q) ; port QD
SER: port SER, sheet Quad 2x1 mux/1A
NetU1_2: U1.2(1D) ; sheet Quad 2x1 mux/1Y
NetU1_12: U1.12(2D) ; sheet Quad 2x1 mux/2Y
NetU2_2: U2.2(1D) ; sheet Quad 2x1 mux/3Y
NetU2_12: U2.12(2D) ; sheet Quad 2x1 mux/4Y

Not connected (* = marked no-connect by the designer): U1 6(~1Q) 8(~2Q); U2 6(~1Q) 8(~2Q)

### Channels
Universal register 16bit/Universal Register 4Bit: designators end in _Universal_register_16bit_Universal_Register_4Bit#1; ports -CLR=Vdd A=NetU2_Universal_register_16bit_Universal_Register_4Bit_Quad_2x1_mux#1_5 B=NetU2_Universal_register_16bit_Universal_Register_4Bit_Quad_2x1_mux#1_13 C=NetU3_Universal_register_16bit_Universal_Register_4Bit_Quad_2x1_mux#1_5 CLK=NetU1_Universal_register_16bit_Universal_Register_4Bit#1_3 D=NetU3_Universal_register_16bit_Universal_Register_4Bit_Quad_2x1_mux#1_13 LD=Vdd QA=NetU1_Universal_register_16bit_Universal_Register_4Bit#1_5 QB=NetU1_Universal_register_16bit_Universal_Register_4Bit#1_9 QC=NetU2_Universal_register_16bit_Universal_Register_4Bit#1_5 QD=NetU2_Universal_register_16bit_Universal_Register_4Bit#1_9 SER=NetU2_Universal_register_16bit_Universal_Register_4Bit_Quad_2x1_mux#1_1
Universal register 16bit/Universal Register 4Bit: designators end in _Universal_register_16bit_Universal_Register_4Bit#2; ports -CLR=Vdd A=NetU2_Universal_register_16bit_Universal_Register_4Bit_Quad_2x1_mux#2_5 B=NetU2_Universal_register_16bit_Universal_Register_4Bit_Quad_2x1_mux#2_13 C=NetU3_Universal_register_16bit_Universal_Register_4Bit_Quad_2x1_mux#2_5 CLK=NetU1_Universal_register_16bit_Universal_Register_4Bit#1_3 D=NetU3_Universal_register_16bit_Universal_Register_4Bit_Quad_2x1_mux#2_13 LD=Vdd QA=NetU1_Universal_register_16bit_Universal_Register_4Bit#2_5 QB=NetU1_Universal_register_16bit_Universal_Register_4Bit#2_9 QC=NetU2_Universal_register_16bit_Universal_Register_4Bit#2_5 QD=NetU2_Universal_register_16bit_Universal_Register_4Bit#2_9 SER=NetU2_Universal_register_16bit_Universal_Register_4Bit#1_9
Universal register 16bit/Universal Register 4Bit: designators end in _Universal_register_16bit_Universal_Register_4Bit#3; ports -CLR=Vdd A=NetU2_Universal_register_16bit_Universal_Register_4Bit_Quad_2x1_mux#3_5 B=NetU2_Universal_register_16bit_Universal_Register_4Bit_Quad_2x1_mux#3_13 C=NetU3_Universal_register_16bit_Universal_Register_4Bit_Quad_2x1_mux#3_5 CLK=NetU1_Universal_register_16bit_Universal_Register_4Bit#1_3 D=NetU3_Universal_register_16bit_Universal_Register_4Bit_Quad_2x1_mux#3_13 LD=Vdd QA=NetU1_Universal_register_16bit_Universal_Register_4Bit#3_5 QB=NetU1_Universal_register_16bit_Universal_Register_4Bit#3_9 QC=NetU2_Universal_register_16bit_Universal_Register_4Bit#3_5 QD=NetU2_Universal_register_16bit_Universal_Register_4Bit#3_9 SER=NetU2_Universal_register_16bit_Universal_Register_4Bit#2_9
Universal register 16bit/Universal Register 4Bit: designators end in _Universal_register_16bit_Universal_Register_4Bit#4; ports -CLR=Vdd A=NetU2_Universal_register_16bit_Universal_Register_4Bit_Quad_2x1_mux#4_5 B=NetU2_Universal_register_16bit_Universal_Register_4Bit_Quad_2x1_mux#4_13 C=NetU3_Universal_register_16bit_Universal_Register_4Bit_Quad_2x1_mux#4_5 CLK=NetU1_Universal_register_16bit_Universal_Register_4Bit#1_3 D=NetU3_Universal_register_16bit_Universal_Register_4Bit_Quad_2x1_mux#4_13 LD=Vdd QA=NetU1_Universal_register_16bit_Universal_Register_4Bit#4_5 QB=NetU1_Universal_register_16bit_Universal_Register_4Bit#4_9 QC=NetU2_Universal_register_16bit_Universal_Register_4Bit#4_5 QD=NetU2_Universal_register_16bit_Universal_Register_4Bit#4_9 SER=NetU2_Universal_register_16bit_Universal_Register_4Bit#3_9
Universal register 16bit/Universal Register 4Bit: designators end in _Universal_register_16bit_Universal_Register_4Bit#5; ports -CLR=Vdd A=NetU1_Universal_register_16bit_Universal_Register_4Bit#1_5 B=NetU1_Universal_register_16bit_Universal_Register_4Bit#1_9 C=NetU2_Universal_register_16bit_Universal_Register_4Bit#1_5 CLK=NetU1_Universal_register_16bit_Universal_Register_4Bit#5_3 D=NetU2_Universal_register_16bit_Universal_Register_4Bit#1_9 LD=NetU1_Universal_register_16bit_Quad_2x1_mux#2_1 QA=NetU1_Universal_register_16bit_Universal_Register_4Bit#5_5 QB=NetU1_Universal_register_16bit_Universal_Register_4Bit#5_9 QC=NetU2_Universal_register_16bit_Universal_Register_4Bit#5_5 QD=NetU2_Universal_register_16bit_Universal_Register_4Bit#5_9 SER=NetU2_Universal_register_16bit_Universal_Register_4Bit_Quad_2x1_mux#5_1
Universal register 16bit/Universal Register 4Bit: designators end in _Universal_register_16bit_Universal_Register_4Bit#6; ports -CLR=Vdd A=NetU1_Universal_register_16bit_Universal_Register_4Bit#2_5 B=NetU1_Universal_register_16bit_Universal_Register_4Bit#2_9 C=NetU2_Universal_register_16bit_Universal_Register_4Bit#2_5 CLK=NetU1_Universal_register_16bit_Universal_Register_4Bit#5_3 D=NetU2_Universal_register_16bit_Universal_Register_4Bit#2_9 LD=NetU1_Universal_register_16bit_Quad_2x1_mux#2_1 QA=NetU1_Universal_register_16bit_Universal_Register_4Bit#6_5 QB=NetU1_Universal_register_16bit_Universal_Register_4Bit#6_9 QC=NetU2_Universal_register_16bit_Universal_Register_4Bit#6_5 QD=NetU2_Universal_register_16bit_Universal_Register_4Bit#6_9 SER=NetU2_Universal_register_16bit_Universal_Register_4Bit#5_9
Universal register 16bit/Universal Register 4Bit: designators end in _Universal_register_16bit_Universal_Register_4Bit#7; ports -CLR=Vdd A=NetU1_Universal_register_16bit_Universal_Register_4Bit#3_5 B=NetU1_Universal_register_16bit_Universal_Register_4Bit#3_9 C=NetU2_Universal_register_16bit_Universal_Register_4Bit#3_5 CLK=NetU1_Universal_register_16bit_Universal_Register_4Bit#5_3 D=NetU2_Universal_register_16bit_Universal_Register_4Bit#3_9 LD=NetU1_Universal_register_16bit_Quad_2x1_mux#2_1 QA=NetU1_Universal_register_16bit_Universal_Register_4Bit#7_5 QB=NetU1_Universal_register_16bit_Universal_Register_4Bit#7_9 QC=NetU2_Universal_register_16bit_Universal_Register_4Bit#7_5 QD=NetU2_Universal_register_16bit_Universal_Register_4Bit#7_9 SER=NetU2_Universal_register_16bit_Universal_Register_4Bit#6_9
Universal register 16bit/Universal Register 4Bit: designators end in _Universal_register_16bit_Universal_Register_4Bit#8; ports -CLR=Vdd A=NetU1_Universal_register_16bit_Universal_Register_4Bit#4_5 B=NetU1_Universal_register_16bit_Universal_Register_4Bit#4_9 C=NetU2_Universal_register_16bit_Universal_Register_4Bit#4_5 CLK=NetU1_Universal_register_16bit_Universal_Register_4Bit#5_3 D=NetU2_Universal_register_16bit_Universal_Register_4Bit#4_9 LD=NetU1_Universal_register_16bit_Quad_2x1_mux#2_1 QA=NetU1_Universal_register_16bit_Universal_Register_4Bit#8_5 QB=NetU1_Universal_register_16bit_Universal_Register_4Bit#8_9 QC=NetU2_Universal_register_16bit_Universal_Register_4Bit#8_5 QD=NetU2_Universal_register_16bit_Universal_Register_4Bit#8_9 SER=NetU2_Universal_register_16bit_Universal_Register_4Bit#7_9

### Notes on the sheet
- Title
- Date
- Part Number
- Revision
- Sheet
- of
- Drawn By
- File

### Library data of the parts
U1 U2 = SN74LS74A: as U3#1 on sheet DVT SPI buffer; Published: 24.11.2016; PackageDescription: DIP14; Publisher: Sebastian Kulik; Price: 0.48

## Sheet Quad 2x1 mux.SchDoc: Quad 2x1 mux
size A4; SheetNumber: 1; SheetTotal: 1; PartNumber: PNxxx; Drawn By: Sebastian Kulik; ProjectName: DVT SPI Buffer
Used 10 times, as channels Universal register 16bit/Universal Register 4Bit/Quad 2x1 mux, Universal register 16bit/Quad 2x1 mux, Universal register 16bit/Universal Register 4Bit/Quad 2x1 mux, Universal register 16bit/Universal Register 4Bit/Quad 2x1 mux, Universal register 16bit/Universal Register 4Bit/Quad 2x1 mux, Universal register 16bit/Universal Register 4Bit/Quad 2x1 mux, Universal register 16bit/Quad 2x1 mux, Universal register 16bit/Universal Register 4Bit/Quad 2x1 mux, Universal register 16bit/Universal Register 4Bit/Quad 2x1 mux, Universal register 16bit/Universal Register 4Bit/Quad 2x1 mux. Parts and nets are listed once, with the designators drawn on the sheet.
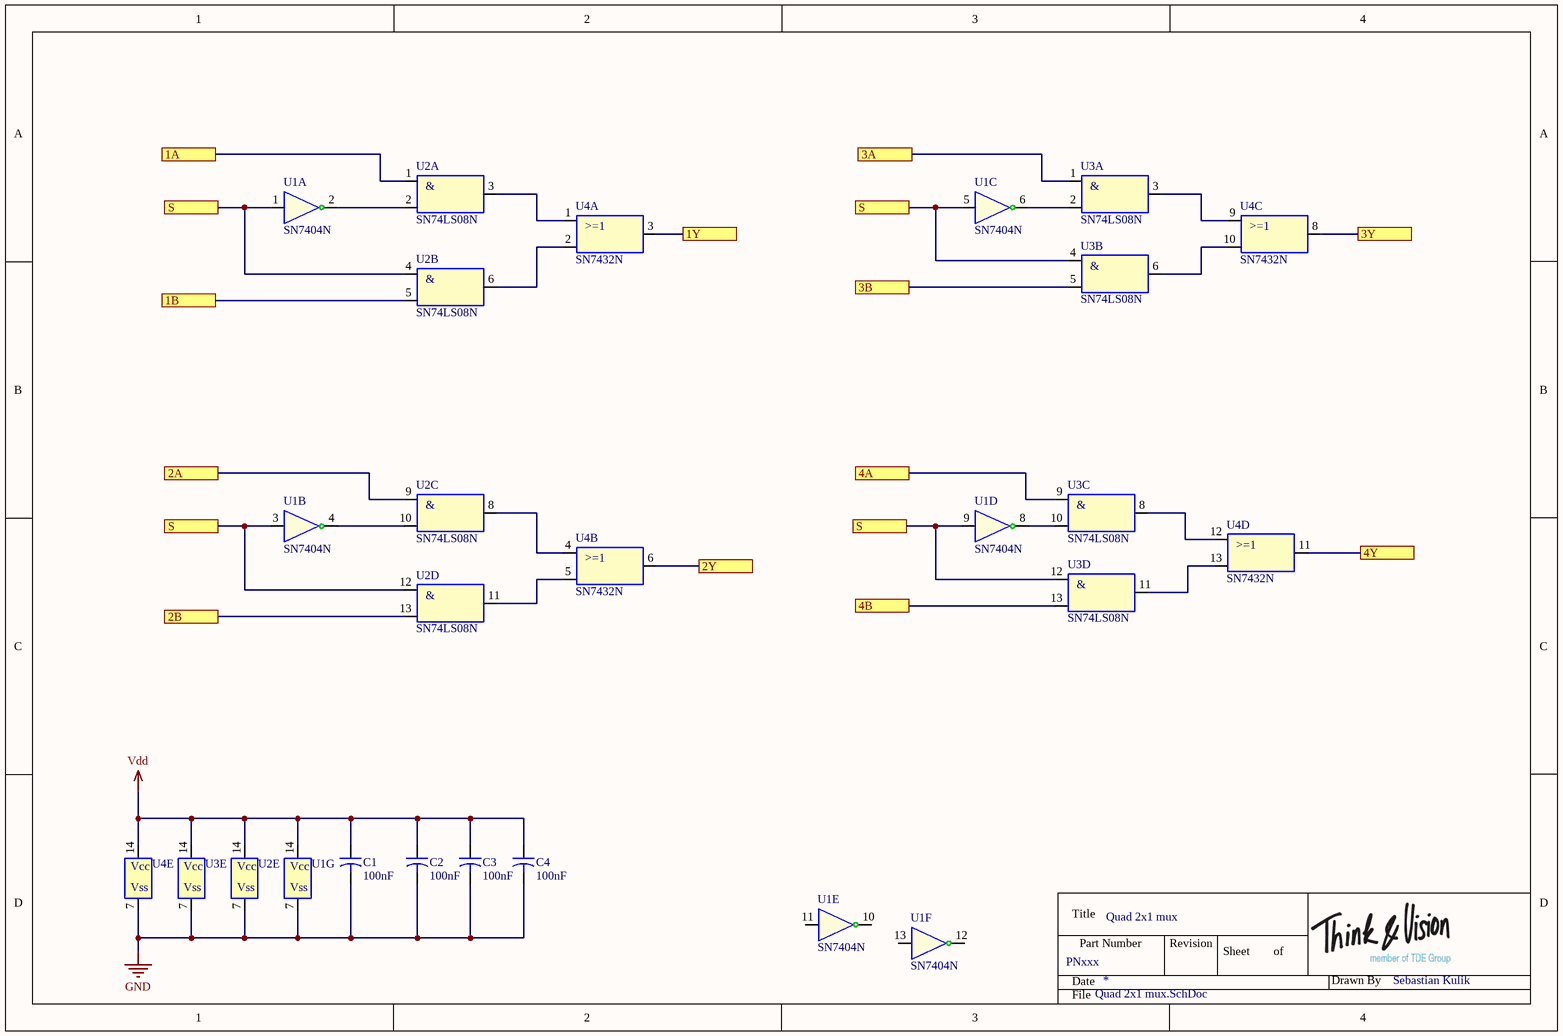
[diagram p5: Quad 2x1 mux.SchDoc]

### Parts
C1  value 100nF  [Dummy-10mm]  (hidden comment: Capacitor-Dummy-THT)
C2  value 100nF  [Dummy-10mm]  (hidden comment: Capacitor-Dummy-THT)
C3  value 100nF  [Dummy-10mm]  (hidden comment: Capacitor-Dummy-THT)
C4  value 100nF  [Dummy-10mm]  (hidden comment: Capacitor-Dummy-THT)
U1  SN7404N  [DIP-14]  (parts A,B,C,D,E,F,G of 7)
U2  SN74LS08N  [DIP-14]  (parts A,B,C,D,E of 5)
U3  SN74LS08N  [DIP-14]  (parts A,B,C,D,E of 5)
U4  SN7432N  [DIP-14]  (parts A,B,C,D,E of 5)

### Ports
1A, 1B, 1Y, 2A, 2B, 2Y, 3A, 3B, 3Y, 4A, 4B, 4Y, S

### Nets
GND: C1.2 C2.2 C3.2 C4.2 U1.7(Vss) U2.7(Vss) U3.7(Vss) U4.7(Vss)
Vdd: C1.1 C2.1 C3.1 C4.1 U1.14(Vcc) U2.14(Vcc) U3.14(Vcc) U4.14(Vcc)
1A: U2.1(1A) ; port 1A
1B: U2.5(2B) ; port 1B
1Y: U4.3(Y1) ; port 1Y
2A: U2.9(3A) ; port 2A
2B: U2.13(4B) ; port 2B
2Y: U4.6(Y2) ; port 2Y
3A: U3.1(1A) ; port 3A
3B: U3.5(2B) ; port 3B
3Y: U4.8(Y3) ; port 3Y
4A: U3.9(3A) ; port 4A
4B: U3.13(4B) ; port 4B
4Y: U4.11(Y4) ; port 4Y
S: U1.1(1A) U1.3(2A) U1.5(3A) U1.9(4A) U2.4(2A) U2.12(4A) U3.4(2A) U3.12(4A) ; port S
NetU1_2: U1.2(1Y) U2.2(1B)
NetU1_4: U1.4(2Y) U2.10(3B)
NetU1_6: U1.6(3Y) U3.2(1B)
NetU1_8: U1.8(Y4) U3.10(3B)
NetU2_3: U2.3(Y1) U4.1(1A)
NetU2_6: U2.6(Y2) U4.2(1B)
NetU2_8: U2.8(Y3) U4.4(2A)
NetU2_11: U2.11(Y4) U4.5(2B)
NetU3_3: U3.3(Y1) U4.9(3A)
NetU3_6: U3.6(Y2) U4.10(3B)
NetU3_8: U3.8(Y3) U4.12(4A)
NetU3_11: U3.11(Y4) U4.13(4B)

Not connected (* = marked no-connect by the designer): U1 10(5Y) 11(5A) 12(6Y) 13(6A)

### Channels
Universal register 16bit/Universal Register 4Bit/Quad 2x1 mux: designators end in _Universal_register_16bit_Universal_Register_4Bit_Quad_2x1_mux#1; ports 1A=NetU2_Universal_register_16bit_Universal_Register_4Bit_Quad_2x1_mux#1_1 1B=NetU2_Universal_register_16bit_Universal_Register_4Bit_Quad_2x1_mux#1_5 1Y=NetU1_Universal_register_16bit_Universal_Register_4Bit#1_2 2A=NetU1_Universal_register_16bit_Universal_Register_4Bit#1_5 2B=NetU2_Universal_register_16bit_Universal_Register_4Bit_Quad_2x1_mux#1_13 2Y=NetU1_Universal_register_16bit_Universal_Register_4Bit#1_12 3A=NetU1_Universal_register_16bit_Universal_Register_4Bit#1_9 3B=NetU3_Universal_register_16bit_Universal_Register_4Bit_Quad_2x1_mux#1_5 3Y=NetU2_Universal_register_16bit_Universal_Register_4Bit#1_2 4A=NetU2_Universal_register_16bit_Universal_Register_4Bit#1_5 4B=NetU3_Universal_register_16bit_Universal_Register_4Bit_Quad_2x1_mux#1_13 4Y=NetU2_Universal_register_16bit_Universal_Register_4Bit#1_12 S=Vdd
Universal register 16bit/Quad 2x1 mux: designators end in _Universal_register_16bit_Quad_2x1_mux#1; ports 1A=NetU2#2_11 1B=NetU2_Universal_register_16bit_Quad_2x1_mux#1_5 1Y=NetU1_Universal_register_16bit_Universal_Register_4Bit#1_3 2A=NetU2_Universal_register_16bit_Quad_2x1_mux#1_9 2B=NetU2_Universal_register_16bit_Quad_2x1_mux#1_13 2Y=NetU4_Universal_register_16bit_Quad_2x1_mux#1_6 3A=NetU3_Universal_register_16bit_Quad_2x1_mux#1_1 3B=NetU3_Universal_register_16bit_Quad_2x1_mux#1_5 3Y=NetU4_Universal_register_16bit_Quad_2x1_mux#1_8 4A=NetU3_Universal_register_16bit_Quad_2x1_mux#1_9 4B=NetU3_Universal_register_16bit_Quad_2x1_mux#1_13 4Y=NetU4_Universal_register_16bit_Quad_2x1_mux#1_11 S=Vdd
Universal register 16bit/Universal Register 4Bit/Quad 2x1 mux: designators end in _Universal_register_16bit_Universal_Register_4Bit_Quad_2x1_mux#2; ports 1A=NetU2_Universal_register_16bit_Universal_Register_4Bit#1_9 1B=NetU2_Universal_register_16bit_Universal_Register_4Bit_Quad_2x1_mux#2_5 1Y=NetU1_Universal_register_16bit_Universal_Register_4Bit#2_2 2A=NetU1_Universal_register_16bit_Universal_Register_4Bit#2_5 2B=NetU2_Universal_register_16bit_Universal_Register_4Bit_Quad_2x1_mux#2_13 2Y=NetU1_Universal_register_16bit_Universal_Register_4Bit#2_12 3A=NetU1_Universal_register_16bit_Universal_Register_4Bit#2_9 3B=NetU3_Universal_register_16bit_Universal_Register_4Bit_Quad_2x1_mux#2_5 3Y=NetU2_Universal_register_16bit_Universal_Register_4Bit#2_2 4A=NetU2_Universal_register_16bit_Universal_Register_4Bit#2_5 4B=NetU3_Universal_register_16bit_Universal_Register_4Bit_Quad_2x1_mux#2_13 4Y=NetU2_Universal_register_16bit_Universal_Register_4Bit#2_12 S=Vdd
Universal register 16bit/Universal Register 4Bit/Quad 2x1 mux: designators end in _Universal_register_16bit_Universal_Register_4Bit_Quad_2x1_mux#3; ports 1A=NetU2_Universal_register_16bit_Universal_Register_4Bit#2_9 1B=NetU2_Universal_register_16bit_Universal_Register_4Bit_Quad_2x1_mux#3_5 1Y=NetU1_Universal_register_16bit_Universal_Register_4Bit#3_2 2A=NetU1_Universal_register_16bit_Universal_Register_4Bit#3_5 2B=NetU2_Universal_register_16bit_Universal_Register_4Bit_Quad_2x1_mux#3_13 2Y=NetU1_Universal_register_16bit_Universal_Register_4Bit#3_12 3A=NetU1_Universal_register_16bit_Universal_Register_4Bit#3_9 3B=NetU3_Universal_register_16bit_Universal_Register_4Bit_Quad_2x1_mux#3_5 3Y=NetU2_Universal_register_16bit_Universal_Register_4Bit#3_2 4A=NetU2_Universal_register_16bit_Universal_Register_4Bit#3_5 4B=NetU3_Universal_register_16bit_Universal_Register_4Bit_Quad_2x1_mux#3_13 4Y=NetU2_Universal_register_16bit_Universal_Register_4Bit#3_12 S=Vdd
Universal register 16bit/Universal Register 4Bit/Quad 2x1 mux: designators end in _Universal_register_16bit_Universal_Register_4Bit_Quad_2x1_mux#4; ports 1A=NetU2_Universal_register_16bit_Universal_Register_4Bit#3_9 1B=NetU2_Universal_register_16bit_Universal_Register_4Bit_Quad_2x1_mux#4_5 1Y=NetU1_Universal_register_16bit_Universal_Register_4Bit#4_2 2A=NetU1_Universal_register_16bit_Universal_Register_4Bit#4_5 2B=NetU2_Universal_register_16bit_Universal_Register_4Bit_Quad_2x1_mux#4_13 2Y=NetU1_Universal_register_16bit_Universal_Register_4Bit#4_12 3A=NetU1_Universal_register_16bit_Universal_Register_4Bit#4_9 3B=NetU3_Universal_register_16bit_Universal_Register_4Bit_Quad_2x1_mux#4_5 3Y=NetU2_Universal_register_16bit_Universal_Register_4Bit#4_2 4A=NetU2_Universal_register_16bit_Universal_Register_4Bit#4_5 4B=NetU3_Universal_register_16bit_Universal_Register_4Bit_Quad_2x1_mux#4_13 4Y=NetU2_Universal_register_16bit_Universal_Register_4Bit#4_12 S=Vdd
Universal register 16bit/Universal Register 4Bit/Quad 2x1 mux: designators end in _Universal_register_16bit_Universal_Register_4Bit_Quad_2x1_mux#5; ports 1A=NetU2_Universal_register_16bit_Universal_Register_4Bit_Quad_2x1_mux#5_1 1B=NetU1_Universal_register_16bit_Universal_Register_4Bit#1_5 1Y=NetU1_Universal_register_16bit_Universal_Register_4Bit#5_2 2A=NetU1_Universal_register_16bit_Universal_Register_4Bit#5_5 2B=NetU1_Universal_register_16bit_Universal_Register_4Bit#1_9 2Y=NetU1_Universal_register_16bit_Universal_Register_4Bit#5_12 3A=NetU1_Universal_register_16bit_Universal_Register_4Bit#5_9 3B=NetU2_Universal_register_16bit_Universal_Register_4Bit#1_5 3Y=NetU2_Universal_register_16bit_Universal_Register_4Bit#5_2 4A=NetU2_Universal_register_16bit_Universal_Register_4Bit#5_5 4B=NetU2_Universal_register_16bit_Universal_Register_4Bit#1_9 4Y=NetU2_Universal_register_16bit_Universal_Register_4Bit#5_12 S=NetU1_Universal_register_16bit_Quad_2x1_mux#2_1
Universal register 16bit/Quad 2x1 mux: designators end in _Universal_register_16bit_Quad_2x1_mux#2; ports 1A=NetU2_Universal_register_16bit_Quad_2x1_mux#2_1 1B=NetU1#2_11 1Y=NetU1_Universal_register_16bit_Universal_Register_4Bit#5_3 2A=NetU2_Universal_register_16bit_Quad_2x1_mux#2_9 2B=NetU2_Universal_register_16bit_Quad_2x1_mux#2_13 2Y=NetU4_Universal_register_16bit_Quad_2x1_mux#2_6 3A=NetU3_Universal_register_16bit_Quad_2x1_mux#2_1 3B=NetU3_Universal_register_16bit_Quad_2x1_mux#2_5 3Y=NetU4_Universal_register_16bit_Quad_2x1_mux#2_8 4A=NetU3_Universal_register_16bit_Quad_2x1_mux#2_9 4B=NetU3_Universal_register_16bit_Quad_2x1_mux#2_13 4Y=NetU4_Universal_register_16bit_Quad_2x1_mux#2_11 S=NetU1_Universal_register_16bit_Quad_2x1_mux#2_1
Universal register 16bit/Universal Register 4Bit/Quad 2x1 mux: designators end in _Universal_register_16bit_Universal_Register_4Bit_Quad_2x1_mux#6; ports 1A=NetU2_Universal_register_16bit_Universal_Register_4Bit#5_9 1B=NetU1_Universal_register_16bit_Universal_Register_4Bit#2_5 1Y=NetU1_Universal_register_16bit_Universal_Register_4Bit#6_2 2A=NetU1_Universal_register_16bit_Universal_Register_4Bit#6_5 2B=NetU1_Universal_register_16bit_Universal_Register_4Bit#2_9 2Y=NetU1_Universal_register_16bit_Universal_Register_4Bit#6_12 3A=NetU1_Universal_register_16bit_Universal_Register_4Bit#6_9 3B=NetU2_Universal_register_16bit_Universal_Register_4Bit#2_5 3Y=NetU2_Universal_register_16bit_Universal_Register_4Bit#6_2 4A=NetU2_Universal_register_16bit_Universal_Register_4Bit#6_5 4B=NetU2_Universal_register_16bit_Universal_Register_4Bit#2_9 4Y=NetU2_Universal_register_16bit_Universal_Register_4Bit#6_12 S=NetU1_Universal_register_16bit_Quad_2x1_mux#2_1
Universal register 16bit/Universal Register 4Bit/Quad 2x1 mux: designators end in _Universal_register_16bit_Universal_Register_4Bit_Quad_2x1_mux#7; ports 1A=NetU2_Universal_register_16bit_Universal_Register_4Bit#6_9 1B=NetU1_Universal_register_16bit_Universal_Register_4Bit#3_5 1Y=NetU1_Universal_register_16bit_Universal_Register_4Bit#7_2 2A=NetU1_Universal_register_16bit_Universal_Register_4Bit#7_5 2B=NetU1_Universal_register_16bit_Universal_Register_4Bit#3_9 2Y=NetU1_Universal_register_16bit_Universal_Register_4Bit#7_12 3A=NetU1_Universal_register_16bit_Universal_Register_4Bit#7_9 3B=NetU2_Universal_register_16bit_Universal_Register_4Bit#3_5 3Y=NetU2_Universal_register_16bit_Universal_Register_4Bit#7_2 4A=NetU2_Universal_register_16bit_Universal_Register_4Bit#7_5 4B=NetU2_Universal_register_16bit_Universal_Register_4Bit#3_9 4Y=NetU2_Universal_register_16bit_Universal_Register_4Bit#7_12 S=NetU1_Universal_register_16bit_Quad_2x1_mux#2_1
Universal register 16bit/Universal Register 4Bit/Quad 2x1 mux: designators end in _Universal_register_16bit_Universal_Register_4Bit_Quad_2x1_mux#8; ports 1A=NetU2_Universal_register_16bit_Universal_Register_4Bit#7_9 1B=NetU1_Universal_register_16bit_Universal_Register_4Bit#4_5 1Y=NetU1_Universal_register_16bit_Universal_Register_4Bit#8_2 2A=NetU1_Universal_register_16bit_Universal_Register_4Bit#8_5 2B=NetU1_Universal_register_16bit_Universal_Register_4Bit#4_9 2Y=NetU1_Universal_register_16bit_Universal_Register_4Bit#8_12 3A=NetU1_Universal_register_16bit_Universal_Register_4Bit#8_9 3B=NetU2_Universal_register_16bit_Universal_Register_4Bit#4_5 3Y=NetU2_Universal_register_16bit_Universal_Register_4Bit#8_2 4A=NetU2_Universal_register_16bit_Universal_Register_4Bit#8_5 4B=NetU2_Universal_register_16bit_Universal_Register_4Bit#4_9 4Y=NetU2_Universal_register_16bit_Universal_Register_4Bit#8_12 S=NetU1_Universal_register_16bit_Quad_2x1_mux#2_1

### Notes on the sheet
- Title
- Date
- Part Number
- Revision
- Sheet
- of
- Drawn By
- File
- (in symbol SN74LS08N, part A) &
- (in symbol SN74LS08N, part B) &
- (in symbol SN74LS08N, part C) &
- (in symbol SN74LS08N, part D) &
- (in symbol SN7432N, part A) >=1
- (in symbol SN7432N, part B) >=1
- (in symbol SN7432N, part C) >=1
- (in symbol SN7432N, part D) >=1

### Library data of the parts
C1-C4 = Capacitor-Dummy-THT: as C1#1 on sheet J-K-Flip-Flop; Published: 08.12.2015; Part Description: Capacitor-Dummy-THT; Publisher: Sebastian Kulik; PackageDescription: -; Manufacturer: -; Manufacturer PartNr: -; TDE-PN: -; Price: 0.081/50
U1 = SN7404N: as U2#1 on sheet DVT SPI buffer; Published: 24.11.2016; PackageDescription: DIP14; Publisher: Sebastian Kulik; Manufacturer PartNr: SN7404N; Price: 1
U2 U3 = SN74LS08N: as U1#1 on sheet DVT SPI buffer; Published: 24.11.2016; PackageDescription: DIP14; Publisher: Sebastian Kulik; Manufacturer PartNr: SN74LS08N; Price: 0.56
U4 = SN7432N: as U3#2 on sheet SPI Counter; Published: 24.11.2016; PackageDescription: DIP14; Publisher: Sebastian Kulik; Manufacturer PartNr: SN7432N; Price: 1.24

## Sheet Ext counter.SchDoc: Ext counter
size A4; SheetNumber: 1; SheetTotal: 1; PartNumber: Part of; Drawn By: Sebastian Kulik; ProjectName: DVT SPI buffer
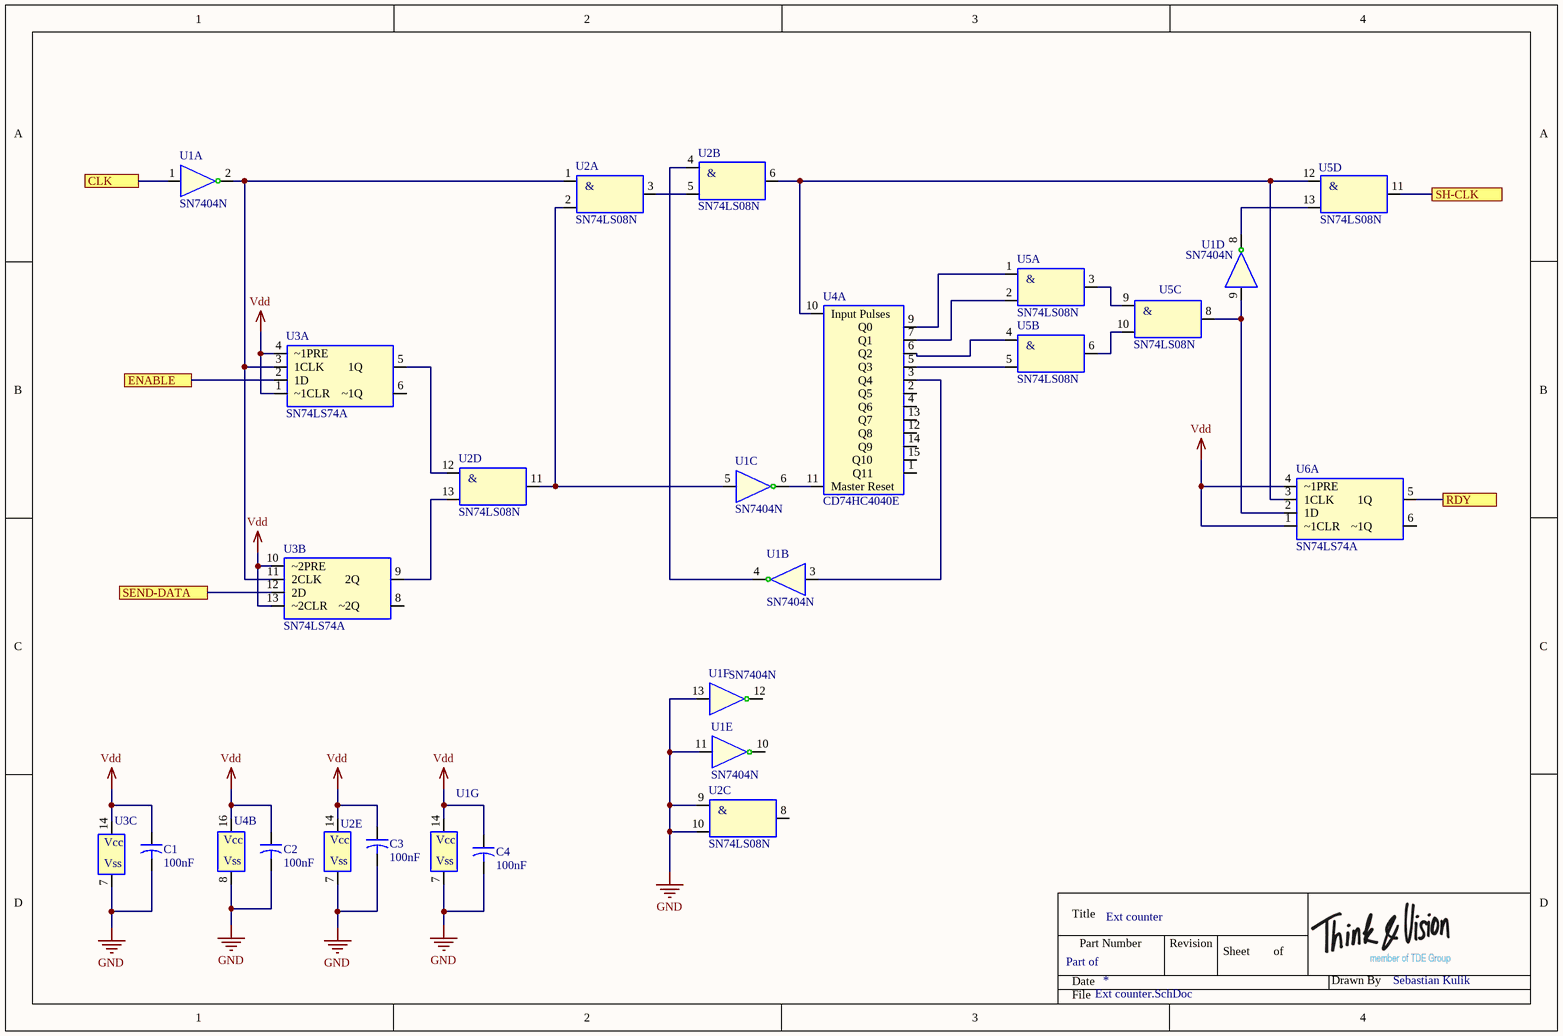
[diagram p6: Ext counter.SchDoc]

### Parts
(Parts that share a designator on the sheet are numbered #1, #2 ... from top to bottom, then left to right.)
C1#2  value 100nF  [Dummy-10mm]  (hidden comment: Capacitor-Dummy-THT)
C2#2  value 100nF  [Dummy-10mm]  (hidden comment: Capacitor-Dummy-THT)
C3#2  value 100nF  [Dummy-10mm]  (hidden comment: Capacitor-Dummy-THT)
C4#2  value 100nF  [Dummy-10mm]  (hidden comment: Capacitor-Dummy-THT)
U1#4  SN7404N  [DIP-14]  (parts A,B,C,D,E,F,G of 7)
U2#4  SN74LS08N  [DIP-14]  (parts A,B,C,D,E of 5)
U3#4  SN74LS74A  [DIP-14]  (parts A,B,C of 3)
U4#3  CD74HC4040E  [DIP-16]  (parts A,B of 2)
U5#2  SN74LS08N  [DIP-14]  (parts A,B,C,D of 5)
U6#2  SN74LS74A  [DIP-14]  (part A of 3)

### Ports
CLK, ENABLE, RDY, SEND-DATA, SH-CLK

### Nets
GND: C1#2.2 C2#2.2 C3#2.2 C4#2.2 U1#4.7(Vss) U1#4.11(5A) U1#4.13(6A) U2#4.7(Vss) U2#4.9(3A) U2#4.10(3B) U3#4.7(Vss) U4#3.8(Vss)
Vdd: C1#2.1 C2#2.1 C3#2.1 C4#2.1 U1#4.14(Vcc) U2#4.14(Vcc) U3#4.1(~1CLR) U3#4.4(~1PRE) U3#4.10(~2PRE) U3#4.13(~2CLR) U3#4.14(Vcc) U4#3.16(Vcc) U6#2.1(~1CLR) U6#2.4(~1PRE)
NetU1#4_1: U1#4.1(1A) ; port CLK
NetU1#4_2: U1#4.2(1Y) U2#4.1(1A) U3#4.3(1CLK) U3#4.11(2CLK)
NetU1#4_3: U1#4.3(2A) U4#3.3(Q4)
NetU1#4_4: U1#4.4(2Y) U2#4.4(2A)
NetU1#4_5: U1#4.5(3A) U2#4.2(1B) U2#4.11(Y4)
NetU1#4_6: U1#4.6(3Y) U4#3.11(Master_Reset)
NetU1#4_8: U1#4.8(Y4) U5#2.13(4B)
NetU1#4_9: U1#4.9(4A) U5#2.8(Y3) U6#2.2(1D)
NetU2#4_3: U2#4.3(Y1) U2#4.5(2B)
NetU2#4_6: U2#4.6(Y2) U4#3.10(Input_Pulses) U5#2.12(4A) U6#2.3(1CLK)
NetU2#4_12: U2#4.12(4A) U3#4.5(1Q)
NetU2#4_13: U2#4.13(4B) U3#4.9(2Q)
NetU2_Universal_register_16bit_Quad_2x1_mux#2_1: U5#2.11(Y4) ; port SH-CLK
NetU3#4_2: U3#4.2(1D) ; port ENABLE
NetU3#4_12: U3#4.12(2D) ; port SEND-DATA
NetU4#3_5: U4#3.5(Q3) U5#2.5(2B)
NetU4#3_6: U4#3.6(Q2) U5#2.4(2A)
NetU4#3_7: U4#3.7(Q1) U5#2.2(1B)
NetU4#3_9: U4#3.9(Q0) U5#2.1(1A)
NetU5#2_3: U5#2.3(Y1) U5#2.9(3A)
NetU5#2_6: U5#2.6(Y2) U5#2.10(3B)
NetU6#2_5: U6#2.5(1Q) ; port RDY

Not connected (* = marked no-connect by the designer): U1#4 10(5Y) 12(6Y); U2#4 8(Y3); U3#4 6(~1Q) 8(~2Q); U4#3 1(Q11) 2(Q5) 4(Q6) 12(Q8) 13(Q7) 14(Q9) 15(Q10); U6#2 6(~1Q)

### Notes on the sheet
- Title
- Date
- Part Number
- Revision
- Sheet
- of
- Drawn By
- File
- (in symbol SN74LS08N, part A) &
- (in symbol SN74LS08N, part B) &
- (in symbol SN74LS08N, part C) &
- (in symbol SN74LS08N, part D) &

### Library data of the parts
C1#2 C2#2 C3#2 C4#2 = Capacitor-Dummy-THT: as C1#1 on sheet J-K-Flip-Flop; Published: 08.12.2015; Part Description: Capacitor-Dummy-THT; Publisher: Sebastian Kulik; PackageDescription: -; Manufacturer: -; Manufacturer PartNr: -; TDE-PN: -; Price: 0.081/50
U1#4 = SN7404N: as U2#1 on sheet DVT SPI buffer; Published: 24.11.2016; PackageDescription: DIP14; Publisher: Sebastian Kulik; Manufacturer PartNr: SN7404N; Price: 1
U2#4 U5#2 = SN74LS08N: as U1#1 on sheet DVT SPI buffer; Published: 24.11.2016; PackageDescription: DIP14; Publisher: Sebastian Kulik; Manufacturer PartNr: SN74LS08N; Price: 0.56
U3#4 U6#2 = SN74LS74A: as U3#1 on sheet DVT SPI buffer; Published: 24.11.2016; PackageDescription: DIP14; Publisher: Sebastian Kulik; Price: 0.48
U4#3 = CD74HC4040E: as U4#1 on sheet SPI Counter; Published: 09.12.2016; PackageDescription: DIP16; Publisher: Sebastian Kulik; Manufacturer PartNr: CD74HC4040E; Price: 0.464/25